# Altium project RK_NVR_DEMO1_RK3588_LP4XD200P232SD8_V21_20211228.PrjPcb (part 3 of 19)

## Sheet 13.RK3588_Flash_SD Controller.SchDoc
size 297 x 209 mm; Revision: V2.1; Schematic Page Number: 11; Page Number: 13; Check: <Checker>; Schematic Name: RK_NVR_DEMO1_RK3588_LP4/4x_V21; Page Count: 43; Page name: 13.RK3588_Flash/SD Controller; Designer: Zhangdz; Schematic Page Count: 99; Revcode: V2.1; DsnPath: E:\Work\SBER\RK3588_SOM\temp\RK_NVR_DEMO1_RK3588_LP4XD200P232SD8_V21_20211228.DSN; SchematicName: RK_NVR_DEMO1_RK3588_LP4/4x_V21; PageName: 13.RK3588_Flash/SD Controller; PageSize: A4; TopSchematic: True
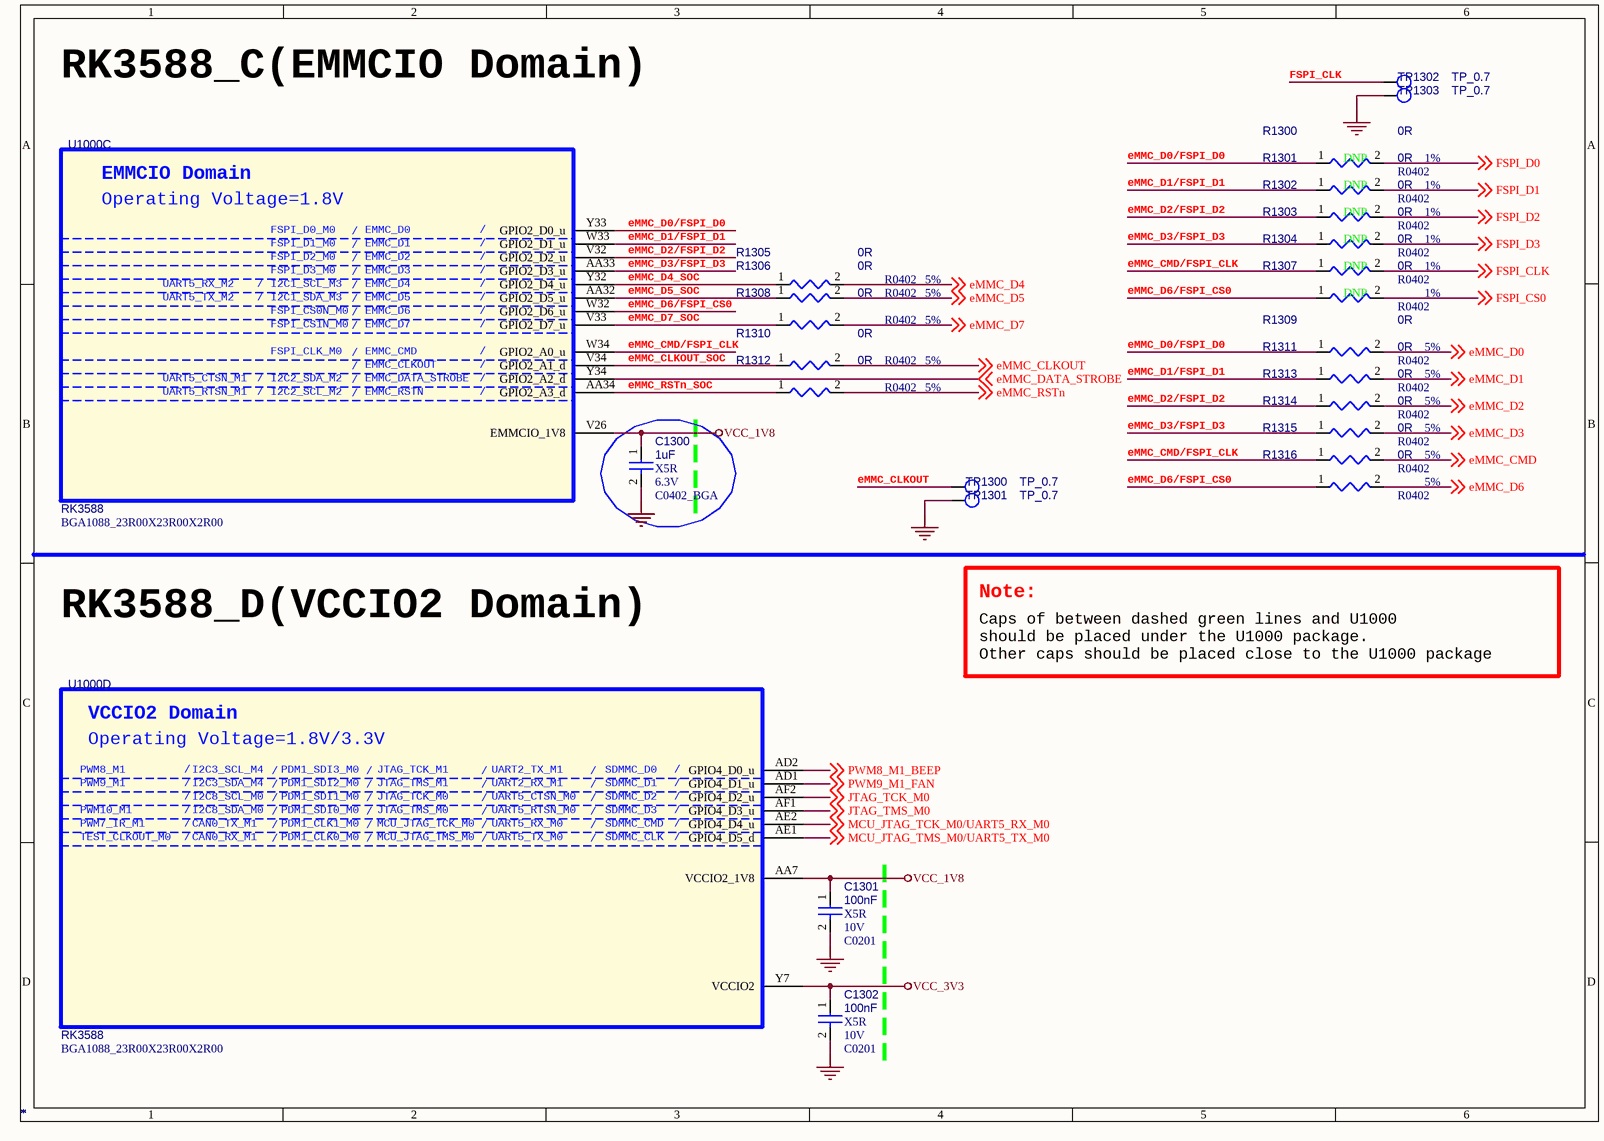
[diagram p28: 13.RK3588_Flash_SD Controller.SchDoc]

### Parts
C1300  *  Voltage: 6.3V  Dielectric: X5R  [C0402_BGA]
C1301  *  Voltage: 10V  Dielectric: X5R  [C0201]
C1302  *  Voltage: 10V  Dielectric: X5R  [C0201]
R1300  *  Tolerance: 1%  OPTION: DNP  [R0402]
R1301  *  Tolerance: 1%  OPTION: DNP  [R0402]
R1302  *  Tolerance: 1%  OPTION: DNP  [R0402]
R1303  *  Tolerance: 1%  OPTION: DNP  [R0402]
R1304  *  Tolerance: 1%  OPTION: DNP  [R0402]
R1305  *  Tolerance: 5%  [R0402]
R1306  *  Tolerance: 5%  [R0402]
R1307  *  Tolerance: 1%  OPTION: DNP  [R0402]
R1308  *  Tolerance: 5%  [R0402]
R1309  *  Tolerance: 5%  [R0402]
R1310  *  Tolerance: 5%  [R0402]
R1311  *  Tolerance: 5%  [R0402]
R1312  *  Tolerance: 5%  [R0402]
R1313  *  Tolerance: 5%  [R0402]
R1314  *  Tolerance: 5%  [R0402]
R1315  *  Tolerance: 5%  [R0402]
R1316  *  Tolerance: 5%  [R0402]
TP1300  *  [TEST]
TP1301  *  [TEST]
TP1302  *  [TEST]
TP1303  *  [TEST]
U1000  *  [BGA1088_23R00X23R00X2R00]  (parts C,D of 26)

### Nets
GND: C1300.2 C1301.2 C1302.2 TP1301.1 TP1303.1
VCC_1V8: C1300.1 C1301.1 U1000.AA7(VCCIO2_1V8) U1000.V26(EMMCIO_1V8)
VCC_3V3: C1302.1 U1000.Y7(VCCIO2)
eMMC_CLKOUT: R1310.2 TP1300.1 ; off-sheet eMMC_CLKOUT
eMMC_CLKOUT_SOC: R1310.1 U1000.V34(GPIO2_A1_d)
eMMC_CMD: R1315.2 ; off-sheet eMMC_CMD
eMMC_CMD/FSPI_CLK: R1304.1 R1315.1 U1000.W34(GPIO2_A0_u)
eMMC_D0: R1309.2 ; off-sheet eMMC_D0
eMMC_D0/FSPI_D0: R1300.1 R1309.1 U1000.Y33(GPIO2_D0_u)
eMMC_D1: R1311.2 ; off-sheet eMMC_D1
eMMC_D1/FSPI_D1: R1301.1 R1311.1 U1000.W33(GPIO2_D1_u)
eMMC_D2: R1313.2 ; off-sheet eMMC_D2
eMMC_D2/FSPI_D2: R1302.1 R1313.1 U1000.V32(GPIO2_D2_u)
eMMC_D3: R1314.2 ; off-sheet eMMC_D3
eMMC_D3/FSPI_D3: R1303.1 R1314.1 U1000.AA33(GPIO2_D3_u)
eMMC_D4: R1305.2 ; off-sheet eMMC_D4
eMMC_D4_SOC: R1305.1 U1000.Y32(GPIO2_D4_u)
eMMC_D5: R1306.2 ; off-sheet eMMC_D5
eMMC_D5_SOC: R1306.1 U1000.AA32(GPIO2_D5_u)
eMMC_D6: R1316.2 ; off-sheet eMMC_D6
eMMC_D6/FSPI_CS0: R1307.1 R1316.1 U1000.W32(GPIO2_D6_u)
eMMC_D7: R1308.2 ; off-sheet eMMC_D7
eMMC_D7_SOC: R1308.1 U1000.V33(GPIO2_D7_u)
eMMC_DATA_STROBE: U1000.Y34(GPIO2_A2_d) ; off-sheet eMMC_DATA_STROBE
eMMC_RSTn: R1312.2 ; off-sheet eMMC_RSTn
eMMC_RSTn_SOC: R1312.1 U1000.AA34(GPIO2_A3_d)
FSPI_CLK: R1304.2 TP1302.1 ; off-sheet FSPI_CLK
FSPI_CS0: R1307.2 ; off-sheet FSPI_CS0
FSPI_D0: R1300.2 ; off-sheet FSPI_D0
FSPI_D1: R1301.2 ; off-sheet FSPI_D1
FSPI_D2: R1302.2 ; off-sheet FSPI_D2
FSPI_D3: R1303.2 ; off-sheet FSPI_D3
JTAG_TCK_M0: U1000.AF2(GPIO4_D2_u) ; off-sheet JTAG_TCK_M0
JTAG_TMS_M0: U1000.AF1(GPIO4_D3_u) ; off-sheet JTAG_TMS_M0
MCU_JTAG_TCK_M0/UART5_RX_M0: U1000.AE2(GPIO4_D4_u) ; off-sheet MCU_JTAG_TCK_M0/UART5_RX_M0
MCU_JTAG_TMS_M0/UART5_TX_M0: U1000.AE1(GPIO4_D5_d) ; off-sheet MCU_JTAG_TMS_M0/UART5_TX_M0
PWM8_M1_BEEP: U1000.AD2(GPIO4_D0_u) ; off-sheet PWM8_M1_BEEP
PWM9_M1_FAN: U1000.AD1(GPIO4_D1_u) ; off-sheet PWM9_M1_FAN

### Notes on the sheet
- RK3588_C(EMMCIO Domain)
- Note:
- RK3588_D(VCCIO2 Domain)
- Caps of between dashed green lines and U1000
  should be placed under the U1000 package.
  Other caps should be placed close to the U1000 package
- (in symbol SOC_RK3588, part C) EMMCIO Domain; Operating Voltage=1.8V; FSPI_D0_M0; /; EMMC_D0; FSPI_D1_M0; EMMC_D1; FSPI_D2_M0; EMMC_D2; FSPI_D3_M0; EMMC_D3; UART5_RX_M2; I2C1_SCL_M3; EMMC_D4; UART5_TX_M2; I2C1_SDA_M3; EMMC_D5; FSPI_CS0N_M0; EMMC_D6; FSPI_CS1N_M0; EMMC_D7; FSPI_CLK_M0; EMMC_CMD; EMMC_CLKOUT; UART5_CTSN_M1; I2C2_SDA_M2; EMMC_DATA_STROBE; UART5_RTSN_M1; I2C2_SCL_M2; EMMC_RSTN
- (in symbol SOC_RK3588, part D) VCCIO2 Domain; Operating Voltage=1.8V/3.3V; PWM8_M1; /; I2C3_SCL_M4; PDM1_SDI3_M0; JTAG_TCK_M1; UART2_TX_M1; SDMMC_D0; PWM9_M1; I2C3_SDA_M4; PDM1_SDI2_M0; JTAG_TMS_M1; UART2_RX_M1; SDMMC_D1; I2C8_SCL_M0; PDM1_SDI1_M0; JTAG_TCK_M0; UART5_CTSN_M0; SDMMC_D2; PWM10_M1; I2C8_SDA_M0; PDM1_SDI0_M0; JTAG_TMS_M0; UART5_RTSN_M0; SDMMC_D3; PWM7_IR_M1; CAN0_TX_M1; PDM1_CLK1_M0; MCU_JTAG_TCK_M0; UART5_RX_M0; SDMMC_CMD; TEST_CLKOUT_M0; CAN0_RX_M1; PDM1_CLK0_M0; MCU_JTAG_TMS_M0; UART5_TX_M0; SDMMC_CLK

### Library data of the parts
C1300 = CAP NP: cap,1.00uF,+/-10%,6.3V,X5R,C0402; Part Reference: C1300; Manufacturer PN: C1005X5R0J105K050BB; Manufacturer: TDK; Value: 1uF; Tolerance: 10%; Priority: A; PCB Footprint: C0402_BGA; Created by: JJJ; Part Type: C0402; RK PN: C1005X5R0J105K050BB
C1301 = CAP NP: cap,100.00nF,+/-10%,10V,X5R,C0201; Part Reference: C1301; Manufacturer PN: C0603X5R1A104K030BC; Manufacturer: TDK; Value: 100nF; Tolerance: 10%; Priority: A; PCB Footprint: C0201; Created by: JJJ; Part Type: C0201; RK PN: C0603X5R1A104K030BC
C1302 = CAP NP: cap,100.00nF,+/-10%,10V,X5R,C0201; Part Reference: C1302; Manufacturer PN: C0603X5R1A104K030BC; Manufacturer: TDK; Value: 100nF; Tolerance: 10%; Priority: A; PCB Footprint: C0201; Created by: JJJ; Part Type: C0201; RK PN: C0603X5R1A104K030BC
R1300 = RESISTOR_Dup1: НЁУГєсД¤µзЧи,0R,+/-1%,R0402,1/16W.; Part Reference: R1300; Manufacturer: YAGEO; RK PN: RC0402FR-070RL; Priority: A; Wattage: 1/16W; PCB Footprint: R0402; Value: 0R; Part Type: НЁУГєсД¤µзЧи; Manufacturer PN: RC0402FR-070RL; Created by: YTL
R1301 = RESISTOR_Dup1: НЁУГєсД¤µзЧи,0R,+/-1%,R0402,1/16W.; Part Reference: R1301; Manufacturer: YAGEO; RK PN: RC0402FR-070RL; Priority: A; Wattage: 1/16W; PCB Footprint: R0402; Value: 0R; Part Type: НЁУГєсД¤µзЧи; Manufacturer PN: RC0402FR-070RL; Created by: YTL
R1302 = RESISTOR_Dup1: НЁУГєсД¤µзЧи,0R,+/-1%,R0402,1/16W.; Part Reference: R1302; Manufacturer: YAGEO; RK PN: RC0402FR-070RL; Priority: A; Wattage: 1/16W; PCB Footprint: R0402; Value: 0R; Part Type: НЁУГєсД¤µзЧи; Manufacturer PN: RC0402FR-070RL; Created by: YTL
R1303 = RESISTOR_Dup1: НЁУГєсД¤µзЧи,0R,+/-1%,R0402,1/16W.; Part Reference: R1303; Manufacturer: YAGEO; RK PN: RC0402FR-070RL; Priority: A; Wattage: 1/16W; PCB Footprint: R0402; Value: 0R; Part Type: НЁУГєсД¤µзЧи; Manufacturer PN: RC0402FR-070RL; Created by: YTL
R1304 = RESISTOR_Dup1: НЁУГєсД¤µзЧи,0R,+/-1%,R0402,1/16W.; Part Reference: R1304; Manufacturer: YAGEO; RK PN: RC0402FR-070RL; Priority: A; Wattage: 1/16W; PCB Footprint: R0402; Value: 0R; Part Type: НЁУГєсД¤µзЧи; Manufacturer PN: RC0402FR-070RL; Created by: YTL
R1305 = RESISTOR_Dup1: НЁУГєсД¤µзЧи,0R,+/-5%,R0402,1/16W.; Part Reference: R1305; Manufacturer PN: RC0402JR-070RL; Manufacturer: YAGEO; Wattage: 1/16W; Priority: A; PCB Footprint: R0402; Value: 0R; Created by: YTL; Part Type: НЁУГєсД¤µзЧи; RK PN: RC0402JR-070RL
R1306 = RESISTOR_Dup1: НЁУГєсД¤µзЧи,0R,+/-5%,R0402,1/16W.; Part Reference: R1306; Manufacturer: YAGEO; RK PN: RC0402JR-070RL; Priority: A; Wattage: 1/16W; PCB Footprint: R0402; Value: 0R; Part Type: НЁУГєсД¤µзЧи; Manufacturer PN: RC0402JR-070RL; Created by: YTL
R1307 = RESISTOR_Dup1: НЁУГєсД¤µзЧи,0R,+/-1%,R0402,1/16W.; Part Reference: R1307; Manufacturer: YAGEO; RK PN: RC0402FR-070RL; Priority: A; Wattage: 1/16W; PCB Footprint: R0402; Value: 0R; Part Type: НЁУГєсД¤µзЧи; Manufacturer PN: RC0402FR-070RL; Created by: YTL
R1308 = RESISTOR_Dup1: НЁУГєсД¤µзЧи,0R,+/-5%,R0402,1/16W.; Part Reference: R1308; Manufacturer PN: RC0402JR-070RL; Manufacturer: YAGEO; Wattage: 1/16W; Priority: A; PCB Footprint: R0402; Value: 0R; Created by: YTL; Part Type: НЁУГєсД¤µзЧи; RK PN: RC0402JR-070RL
R1309 = RESISTOR_Dup1: НЁУГєсД¤µзЧи,0R,+/-5%,R0402,1/16W.; Part Reference: R1309; Manufacturer PN: RC0402JR-070RL; Manufacturer: YAGEO; Wattage: 1/16W; Priority: A; PCB Footprint: R0402; Value: 0R; Created by: YTL; Part Type: НЁУГєсД¤µзЧи; RK PN: RC0402JR-070RL
R1310 = RESISTOR_Dup1: НЁУГєсД¤µзЧи,0R,+/-5%,R0402,1/16W.; Part Reference: R1310; Manufacturer: YAGEO; RK PN: RC0402JR-070RL; Priority: A; Wattage: 1/16W; PCB Footprint: R0402; Value: 0R; Part Type: НЁУГєсД¤µзЧи; Manufacturer PN: RC0402JR-070RL; Created by: YTL
R1311 = RESISTOR_Dup1: НЁУГєсД¤µзЧи,0R,+/-5%,R0402,1/16W.; Part Reference: R1311; Manufacturer PN: RC0402JR-070RL; Manufacturer: YAGEO; Wattage: 1/16W; Priority: A; PCB Footprint: R0402; Value: 0R; Created by: YTL; Part Type: НЁУГєсД¤µзЧи; RK PN: RC0402JR-070RL
R1312 = RESISTOR_Dup1: НЁУГєсД¤µзЧи,0R,+/-5%,R0402,1/16W.; Part Reference: R1312; Manufacturer: YAGEO; RK PN: RC0402JR-070RL; Priority: A; Wattage: 1/16W; PCB Footprint: R0402; Value: 0R; Part Type: НЁУГєсД¤µзЧи; Manufacturer PN: RC0402JR-070RL; Created by: YTL
R1313 = RESISTOR_Dup1: НЁУГєсД¤µзЧи,0R,+/-5%,R0402,1/16W.; Part Reference: R1313; Manufacturer PN: RC0402JR-070RL; Manufacturer: YAGEO; Wattage: 1/16W; Priority: A; PCB Footprint: R0402; Value: 0R; Created by: YTL; Part Type: НЁУГєсД¤µзЧи; RK PN: RC0402JR-070RL
R1314 = RESISTOR_Dup1: НЁУГєсД¤µзЧи,0R,+/-5%,R0402,1/16W.; Part Reference: R1314; Manufacturer PN: RC0402JR-070RL; Manufacturer: YAGEO; Wattage: 1/16W; Priority: A; PCB Footprint: R0402; Value: 0R; Created by: YTL; Part Type: НЁУГєсД¤µзЧи; RK PN: RC0402JR-070RL
R1315 = RESISTOR_Dup1: НЁУГєсД¤µзЧи,0R,+/-5%,R0402,1/16W.; Part Reference: R1315; Manufacturer PN: RC0402JR-070RL; Manufacturer: YAGEO; Wattage: 1/16W; Priority: A; PCB Footprint: R0402; Value: 0R; Created by: YTL; Part Type: НЁУГєсД¤µзЧи; RK PN: RC0402JR-070RL
R1316 = RESISTOR_Dup1: НЁУГєсД¤µзЧи,0R,+/-5%,R0402,1/16W.; Part Reference: R1316; Manufacturer PN: RC0402JR-070RL; Manufacturer: YAGEO; Wattage: 1/16W; Priority: A; PCB Footprint: R0402; Value: 0R; Created by: YTL; Part Type: НЁУГєсД¤µзЧи; RK PN: RC0402JR-070RL
TP1300 = TP: Test Point 0.7mm; Part Reference: TP1300; PCB Footprint: TP_0R70; Value: TP_0.7; RK PN: TESTPOINT_0R7; Priority: A; Part Type: TP; Created by: JJJ
TP1301 = TP: Test Point 0.7mm; Part Reference: TP1301; PCB Footprint: TP_0R70; Value: TP_0.7; RK PN: TESTPOINT_0R7; Priority: A; Part Type: TP; Created by: JJJ
TP1302 = TP: Test Point 0.7mm; Part Reference: TP1302; PCB Footprint: TP_0R70; Value: TP_0.7; Priority: A; RK PN: TESTPOINT_0R7; Created by: JJJ; Part Type: TP
TP1303 = TP: Test Point 0.7mm; Part Reference: TP1303; PCB Footprint: TP_0R70; Value: TP_0.7; RK PN: TESTPOINT_0R7; Priority: A; Part Type: TP; Created by: JJJ
U1000 = SOC_RK3588: as U1000 on sheet 11.RK3588_OSC_PLL_PMUIO; RK PN: RK3588; Part Type: SOC; Manufacturer PN: RK3588; Created by: YWQ; PCB Footprint: BGA1088_23R00X23R00X2R00

## Sheet 14.RK3588_USB30_USB20_Ctrl.SchDoc
size 420 x 297 mm; Revision: V2.1; Schematic Page Number: 11; Page Number: 14; Check: <Checker>; Schematic Name: RK_NVR_DEMO1_RK3588_LP4/4x_V21; Page Count: 43; Page name: 14.RK3588_USB30/USB20_Ctrl; Designer: Zhangdz; Schematic Page Count: 99; Revcode: V2.1; DsnPath: E:\Work\SBER\RK3588_SOM\temp\RK_NVR_DEMO1_RK3588_LP4XD200P232SD8_V21_20211228.DSN; SchematicName: RK_NVR_DEMO1_RK3588_LP4/4x_V21; PageName: 14.RK3588_USB30/USB20_Ctrl; PageSize: A3; TopSchematic: True
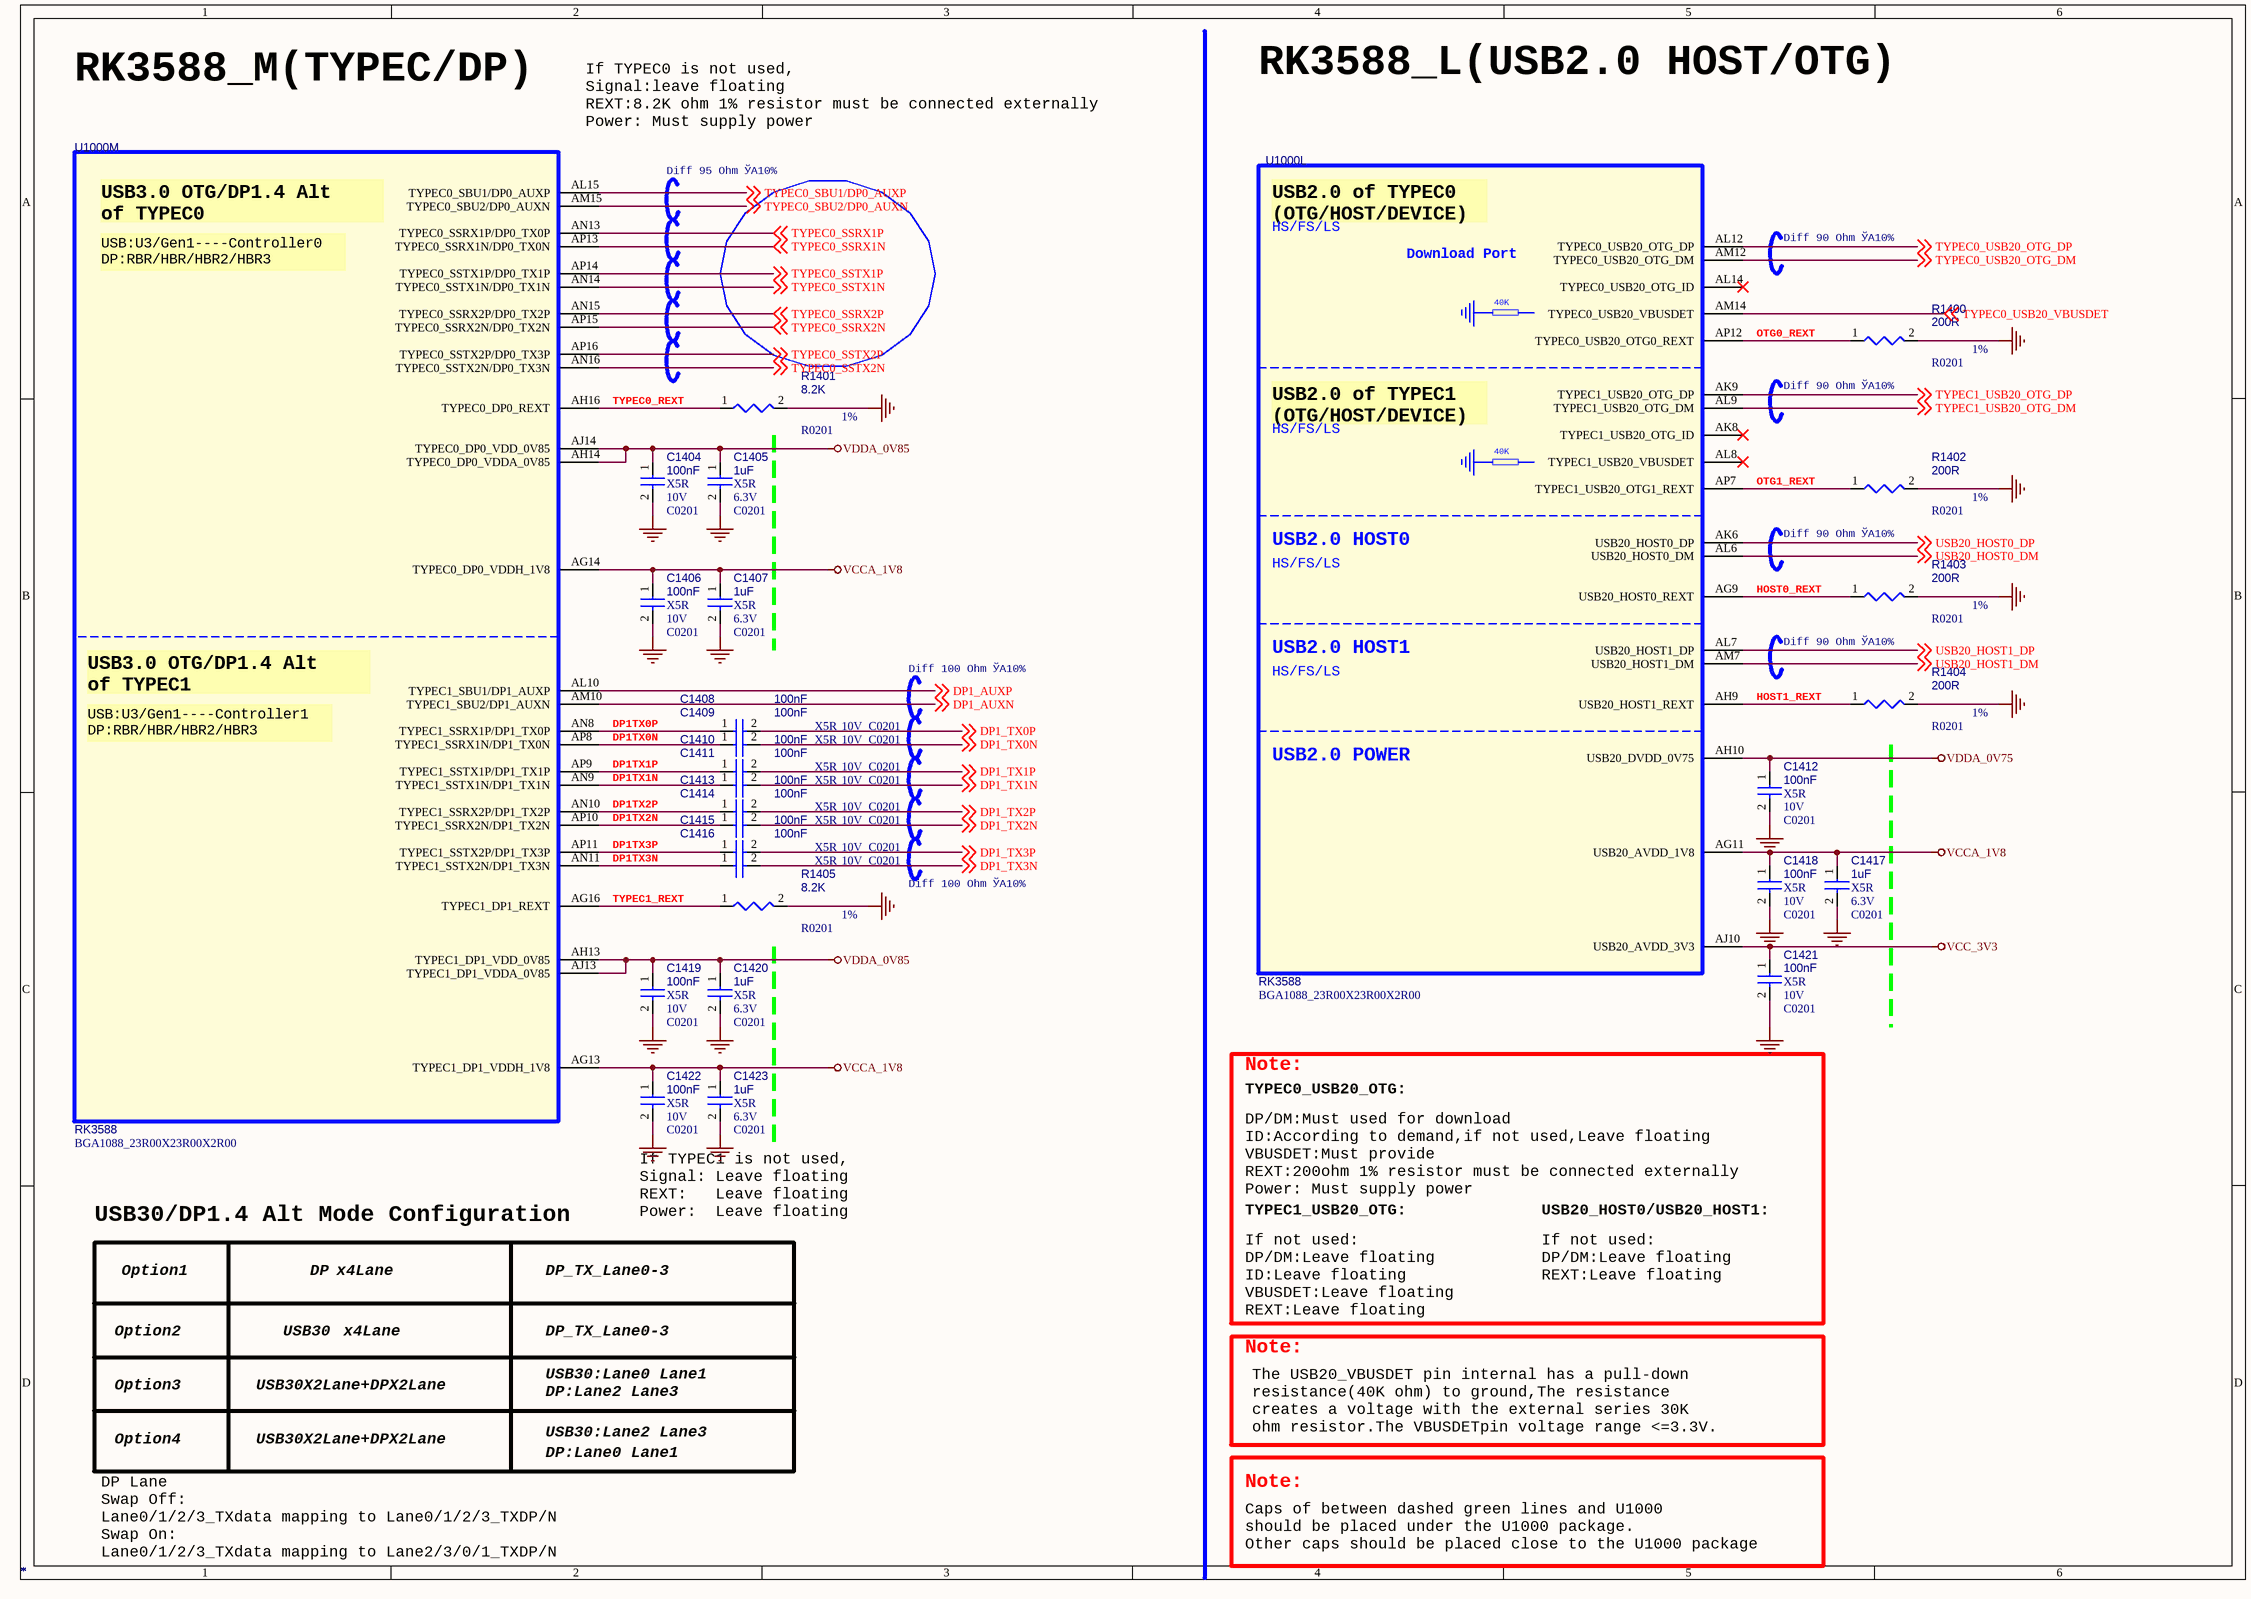
[diagram p29: 14.RK3588_USB30_USB20_Ctrl.SchDoc]

### Parts
C1404  *  Voltage: 10V  Dielectric: X5R  [C0201]
C1405  *  Voltage: 6.3V  Dielectric: X5R  [C0201]
C1406  *  Voltage: 10V  Dielectric: X5R  [C0201]
C1407  *  Voltage: 6.3V  Dielectric: X5R  [C0201]
C1408  *  Voltage: 10V  Dielectric: X5R  [C0201]
C1409  *  Voltage: 10V  Dielectric: X5R  [C0201]
C1410  *  Voltage: 10V  Dielectric: X5R  [C0201]
C1411  *  Voltage: 10V  Dielectric: X5R  [C0201]
C1412  *  Voltage: 10V  Dielectric: X5R  [C0201]
C1413  *  Voltage: 10V  Dielectric: X5R  [C0201]
C1414  *  Voltage: 10V  Dielectric: X5R  [C0201]
C1415  *  Voltage: 10V  Dielectric: X5R  [C0201]
C1416  *  Voltage: 10V  Dielectric: X5R  [C0201]
C1417  *  Voltage: 6.3V  Dielectric: X5R  [C0201]
C1418  *  Voltage: 10V  Dielectric: X5R  [C0201]
C1419  *  Voltage: 10V  Dielectric: X5R  [C0201]
C1420  *  Voltage: 6.3V  Dielectric: X5R  [C0201]
C1421  *  Voltage: 10V  Dielectric: X5R  [C0201]
C1422  *  Voltage: 10V  Dielectric: X5R  [C0201]
C1423  *  Voltage: 6.3V  Dielectric: X5R  [C0201]
R1400  *  PCB Footprint: R0201  Tolerance: 1%  [R0402]
R1401  *  PCB Footprint: R0201  Tolerance: 1%  [R0402]
R1402  *  PCB Footprint: R0201  Tolerance: 1%  [R0402]
R1403  *  PCB Footprint: R0201  Tolerance: 1%  [R0402]
R1404  *  PCB Footprint: R0201  Tolerance: 1%  [R0402]
R1405  *  PCB Footprint: R0201  Tolerance: 1%  [R0402]
U1000  *  [BGA1088_23R00X23R00X2R00]  (parts L,M of 26)

### Nets
GND: C1404.2 C1405.2 C1406.2 C1407.2 C1412.2 C1417.2 C1418.2 C1419.2 C1420.2 C1421.2 C1422.2 C1423.2 R1400.2 R1401.2 R1402.2 R1403.2 R1404.2 R1405.2
VCC_3V3: C1421.1 U1000.AJ10(USB20_AVDD_3V3)
VCCA_1V8: C1406.1 C1407.1 C1417.1 C1418.1 C1422.1 C1423.1 U1000.AG11(USB20_AVDD_1V8) U1000.AG13(TYPEC1_DP1_VDDH_1V8) U1000.AG14(TYPEC0_DP0_VDDH_1V8)
VDDA_0V75: C1412.1 U1000.AH10(USB20_DVDD_0V75)
VDDA_0V85: C1404.1 C1405.1 C1419.1 C1420.1 U1000.AH13(TYPEC1_DP1_VDD_0V85) U1000.AH14(TYPEC0_DP0_VDDA_0V85) U1000.AJ13(TYPEC1_DP1_VDDA_0V85) U1000.AJ14(TYPEC0_DP0_VDD_0V85)
DP1_AUXN: U1000.AM10(TYPEC1_SBU2/DP1_AUXN) ; off-sheet DP1_AUXN
DP1_AUXP: U1000.AL10(TYPEC1_SBU1/DP1_AUXP) ; off-sheet DP1_AUXP
DP1_TX0N: C1409.2 ; off-sheet DP1_TX0N
DP1_TX0P: C1408.2 ; off-sheet DP1_TX0P
DP1_TX1N: C1411.2 ; off-sheet DP1_TX1N
DP1_TX1P: C1410.2 ; off-sheet DP1_TX1P
DP1_TX2N: C1414.2 ; off-sheet DP1_TX2N
DP1_TX2P: C1413.2 ; off-sheet DP1_TX2P
DP1_TX3N: C1416.2 ; off-sheet DP1_TX3N
DP1_TX3P: C1415.2 ; off-sheet DP1_TX3P
DP1TX0N: C1409.1 U1000.AP8(TYPEC1_SSRX1N/DP1_TX0N)
DP1TX0P: C1408.1 U1000.AN8(TYPEC1_SSRX1P/DP1_TX0P)
DP1TX1N: C1411.1 U1000.AN9(TYPEC1_SSTX1N/DP1_TX1N)
DP1TX1P: C1410.1 U1000.AP9(TYPEC1_SSTX1P/DP1_TX1P)
DP1TX2N: C1414.1 U1000.AP10(TYPEC1_SSRX2N/DP1_TX2N)
DP1TX2P: C1413.1 U1000.AN10(TYPEC1_SSRX2P/DP1_TX2P)
DP1TX3N: C1416.1 U1000.AN11(TYPEC1_SSTX2N/DP1_TX3N)
DP1TX3P: C1415.1 U1000.AP11(TYPEC1_SSTX2P/DP1_TX3P)
HOST0_REXT: R1403.1 U1000.AG9(USB20_HOST0_REXT)
HOST1_REXT: R1404.1 U1000.AH9(USB20_HOST1_REXT)
OTG0_REXT: R1400.1 U1000.AP12(TYPEC0_USB20_OTG0_REXT)
OTG1_REXT: R1402.1 U1000.AP7(TYPEC1_USB20_OTG1_REXT)
TYPEC0_REXT: R1401.1 U1000.AH16(TYPEC0_DP0_REXT)
TYPEC0_SBU1/DP0_AUXP: U1000.AL15(TYPEC0_SBU1/DP0_AUXP) ; off-sheet TYPEC0_SBU1/DP0_AUXP
TYPEC0_SBU2/DP0_AUXN: U1000.AM15(TYPEC0_SBU2/DP0_AUXN) ; off-sheet TYPEC0_SBU2/DP0_AUXN
TYPEC0_SSRX1N: U1000.AP13(TYPEC0_SSRX1N/DP0_TX0N) ; off-sheet TYPEC0_SSRX1N
TYPEC0_SSRX1P: U1000.AN13(TYPEC0_SSRX1P/DP0_TX0P) ; off-sheet TYPEC0_SSRX1P
TYPEC0_SSRX2N: U1000.AP15(TYPEC0_SSRX2N/DP0_TX2N) ; off-sheet TYPEC0_SSRX2N
TYPEC0_SSRX2P: U1000.AN15(TYPEC0_SSRX2P/DP0_TX2P) ; off-sheet TYPEC0_SSRX2P
TYPEC0_SSTX1N: U1000.AN14(TYPEC0_SSTX1N/DP0_TX1N) ; off-sheet TYPEC0_SSTX1N
TYPEC0_SSTX1P: U1000.AP14(TYPEC0_SSTX1P/DP0_TX1P) ; off-sheet TYPEC0_SSTX1P
TYPEC0_SSTX2N: U1000.AN16(TYPEC0_SSTX2N/DP0_TX3N) ; off-sheet TYPEC0_SSTX2N
TYPEC0_SSTX2P: U1000.AP16(TYPEC0_SSTX2P/DP0_TX3P) ; off-sheet TYPEC0_SSTX2P
TYPEC0_USB20_OTG_DM: U1000.AM12(TYPEC0_USB20_OTG_DM) ; off-sheet TYPEC0_USB20_OTG_DM
TYPEC0_USB20_OTG_DP: U1000.AL12(TYPEC0_USB20_OTG_DP) ; off-sheet TYPEC0_USB20_OTG_DP
TYPEC0_USB20_VBUSDET: U1000.AM14(TYPEC0_USB20_VBUSDET) ; off-sheet TYPEC0_USB20_VBUSDET
TYPEC1_REXT: R1405.1 U1000.AG16(TYPEC1_DP1_REXT)
TYPEC1_USB20_OTG_DM: U1000.AL9(TYPEC1_USB20_OTG_DM) ; off-sheet TYPEC1_USB20_OTG_DM
TYPEC1_USB20_OTG_DP: U1000.AK9(TYPEC1_USB20_OTG_DP) ; off-sheet TYPEC1_USB20_OTG_DP
USB20_HOST0_DM: U1000.AL6(USB20_HOST0_DM) ; off-sheet USB20_HOST0_DM
USB20_HOST0_DP: U1000.AK6(USB20_HOST0_DP) ; off-sheet USB20_HOST0_DP
USB20_HOST1_DM: U1000.AM7(USB20_HOST1_DM) ; off-sheet USB20_HOST1_DM
USB20_HOST1_DP: U1000.AL7(USB20_HOST1_DP) ; off-sheet USB20_HOST1_DP

Not connected (* = marked no-connect by the designer): U1000 AK8(TYPEC1_USB20_OTG_ID)* AL8(TYPEC1_USB20_VBUSDET)* AL14(TYPEC0_USB20_OTG_ID)*

### Notes on the sheet
- RK3588_M(TYPEC/DP)
- If TYPEC0 is not used,
  Signal:leave floating
  REXT:8.2K ohm 1% resistor must be connected externally
  Power: Must supply power
- RK3588_L(USB2.0 HOST/OTG)
- Diff 95 Ohm ЎА10%
- Diff 90 Ohm ЎА10%
- (near R1400) Diff 90 Ohm ЎА10%
- Diff 100 Ohm ЎА10%
- TYPEC0_USB20_OTG:
- Note:
- DP/DM:Must used for download
  ID:According to demand,if not used,Leave floating
  VBUSDET:Must provide
  REXT:200ohm 1% resistor must be connected externally
  Power: Must supply power
- USB30/DP1.4 Alt Mode Configuration
- If TYPEC1 is not used,
  Signal: Leave floating
  REXT:   Leave floating
  Power:  Leave floating
- TYPEC1_USB20_OTG:
- USB20_HOST0/USB20_HOST1:
- Option2
- Option1
- USB30
- DP
- x4Lane
- DP_TX_Lane0-3
- If not used:
  DP/DM:Leave floating
  ID:Leave floating
  VBUSDET:Leave floating
  REXT:Leave floating
- If not used:
  DP/DM:Leave floating
  REXT:Leave floating
- Option3
- USB30X2Lane+DPX2Lane
- USB30:Lane0 Lane1
- DP:Lane2 Lane3
- Option4
- USB30:Lane2 Lane3
- DP:Lane0 Lane1
- The USB20_VBUSDET pin internal has a pull-down
  resistance(40K ohm) to ground,The resistance
  creates a voltage with the external series 30K
  ohm resistor.The VBUSDETpin voltage range <=3.3V.
- DP Lane
  Swap Off:
  Lane0/1/2/3_TXdata mapping to Lane0/1/2/3_TXDP/N
  Swap On:
  Lane0/1/2/3_TXdata mapping to Lane2/3/0/1_TXDP/N
- Caps of between dashed green lines and U1000
  should be placed under the U1000 package.
  Other caps should be placed close to the U1000 package
- (in symbol SOC_RK3588, part L) USB2.0 of TYPEC0 / (OTG/HOST/DEVICE); HS/FS/LS; Download Port; 40K; USB2.0 of TYPEC1 / (OTG/HOST/DEVICE); USB2.0 HOST0; USB2.0 HOST1; USB2.0 POWER
- (in symbol SOC_RK3588, part M) USB3.0 OTG/DP1.4 Alt / of TYPEC0; USB:U3/Gen1----Controller0 / DP:RBR/HBR/HBR2/HBR3; USB3.0 OTG/DP1.4 Alt / of TYPEC1; USB:U3/Gen1----Controller1 / DP:RBR/HBR/HBR2/HBR3

### Library data of the parts
C1404 = CAP NP: cap,100.00nF,+/-10%,10V,X5R,C0201; Part Reference: C1404; Manufacturer: TDK; Value: 100nF; RK PN: C0603X5R1A104K030BC; Priority: A; Tolerance: 10%; PCB Footprint: C0201; Part Type: C0201; Manufacturer PN: C0603X5R1A104K030BC; Created by: JJJ
C1405 = CAP NP: cap,1.00uF,+/-20%,6.3V,X5R,C0201; Part Reference: C1405; Manufacturer PN: C0603X5R0J105M030BC; Manufacturer: TDK; Value: 1uF; Tolerance: 20%; Priority: A; PCB Footprint: C0201; Created by: JJJ; Part Type: C0201; RK PN: C0603X5R0J105M030BC
C1406 = CAP NP: cap,100.00nF,+/-10%,10V,X5R,C0201; Part Reference: C1406; Manufacturer: TDK; Value: 100nF; RK PN: C0603X5R1A104K030BC; Priority: A; Tolerance: 10%; PCB Footprint: C0201; Part Type: C0201; Manufacturer PN: C0603X5R1A104K030BC; Created by: JJJ
C1407 = CAP NP: cap,1.00uF,+/-20%,6.3V,X5R,C0201; Part Reference: C1407; Manufacturer PN: C0603X5R0J105M030BC; Manufacturer: TDK; Value: 1uF; Tolerance: 20%; Priority: A; PCB Footprint: C0201; Created by: JJJ; Part Type: C0201; RK PN: C0603X5R0J105M030BC
C1408 = CAP NP: cap,100.00nF,+/-10%,10V,X5R,C0201; Part Reference: C1408; Manufacturer: TDK; Value: 100nF; RK PN: C0603X5R1A104K030BC; Priority: A; Tolerance: 10%; PCB Footprint: C0201; Part Type: C0201; Manufacturer PN: C0603X5R1A104K030BC; Created by: JJJ
C1409 = CAP NP: cap,100.00nF,+/-10%,10V,X5R,C0201; Part Reference: C1409; Manufacturer PN: C0603X5R1A104K030BC; Manufacturer: TDK; Value: 100nF; Tolerance: 10%; Priority: A; PCB Footprint: C0201; Created by: JJJ; Part Type: C0201; RK PN: C0603X5R1A104K030BC
C1410 = CAP NP: cap,100.00nF,+/-10%,10V,X5R,C0201; Part Reference: C1410; Manufacturer: TDK; Value: 100nF; RK PN: C0603X5R1A104K030BC; Priority: A; Tolerance: 10%; PCB Footprint: C0201; Part Type: C0201; Manufacturer PN: C0603X5R1A104K030BC; Created by: JJJ
C1411 = CAP NP: cap,100.00nF,+/-10%,10V,X5R,C0201; Part Reference: C1411; Manufacturer PN: C0603X5R1A104K030BC; Manufacturer: TDK; Value: 100nF; Tolerance: 10%; Priority: A; PCB Footprint: C0201; Created by: JJJ; Part Type: C0201; RK PN: C0603X5R1A104K030BC
C1412 = CAP NP: cap,100.00nF,+/-10%,10V,X5R,C0201; Part Reference: C1412; Manufacturer PN: C0603X5R1A104K030BC; Manufacturer: TDK; Value: 100nF; Tolerance: 10%; Priority: A; PCB Footprint: C0201; Created by: JJJ; Part Type: C0201; RK PN: C0603X5R1A104K030BC
C1413 = CAP NP: cap,100.00nF,+/-10%,10V,X5R,C0201; Part Reference: C1413; Manufacturer: TDK; Value: 100nF; RK PN: C0603X5R1A104K030BC; Priority: A; Tolerance: 10%; PCB Footprint: C0201; Part Type: C0201; Manufacturer PN: C0603X5R1A104K030BC; Created by: JJJ
C1414 = CAP NP: cap,100.00nF,+/-10%,10V,X5R,C0201; Part Reference: C1414; Manufacturer PN: C0603X5R1A104K030BC; Manufacturer: TDK; Value: 100nF; Tolerance: 10%; Priority: A; PCB Footprint: C0201; Created by: JJJ; Part Type: C0201; RK PN: C0603X5R1A104K030BC
C1415 = CAP NP: cap,100.00nF,+/-10%,10V,X5R,C0201; Part Reference: C1415; Manufacturer: TDK; Value: 100nF; RK PN: C0603X5R1A104K030BC; Priority: A; Tolerance: 10%; PCB Footprint: C0201; Part Type: C0201; Manufacturer PN: C0603X5R1A104K030BC; Created by: JJJ
C1416 = CAP NP: cap,100.00nF,+/-10%,10V,X5R,C0201; Part Reference: C1416; Manufacturer PN: C0603X5R1A104K030BC; Manufacturer: TDK; Value: 100nF; Tolerance: 10%; Priority: A; PCB Footprint: C0201; Created by: JJJ; Part Type: C0201; RK PN: C0603X5R1A104K030BC
C1417 = CAP NP: cap,1.00uF,+/-20%,6.3V,X5R,C0201; Part Reference: C1417; Manufacturer: TDK; Value: 1uF; RK PN: C0603X5R0J105M030BC; Priority: A; Tolerance: 20%; PCB Footprint: C0201; Part Type: C0201; Manufacturer PN: C0603X5R0J105M030BC; Created by: JJJ
C1418 = CAP NP: cap,100.00nF,+/-10%,10V,X5R,C0201; Part Reference: C1418; Manufacturer PN: C0603X5R1A104K030BC; Manufacturer: TDK; Value: 100nF; Tolerance: 10%; Priority: A; PCB Footprint: C0201; Created by: JJJ; Part Type: C0201; RK PN: C0603X5R1A104K030BC
C1419 = CAP NP: cap,100.00nF,+/-10%,10V,X5R,C0201; Part Reference: C1419; Manufacturer: TDK; Value: 100nF; RK PN: C0603X5R1A104K030BC; Priority: A; Tolerance: 10%; PCB Footprint: C0201; Part Type: C0201; Manufacturer PN: C0603X5R1A104K030BC; Created by: JJJ
C1420 = CAP NP: cap,1.00uF,+/-20%,6.3V,X5R,C0201; Part Reference: C1420; Manufacturer PN: C0603X5R0J105M030BC; Manufacturer: TDK; Value: 1uF; Tolerance: 20%; Priority: A; PCB Footprint: C0201; Created by: JJJ; Part Type: C0201; RK PN: C0603X5R0J105M030BC
C1421 = CAP NP: cap,100.00nF,+/-10%,10V,X5R,C0201; Part Reference: C1421; Manufacturer PN: C0603X5R1A104K030BC; Manufacturer: TDK; Value: 100nF; Tolerance: 10%; Priority: A; PCB Footprint: C0201; Created by: JJJ; Part Type: C0201; RK PN: C0603X5R1A104K030BC
C1422 = CAP NP: cap,100.00nF,+/-10%,10V,X5R,C0201; Part Reference: C1422; Manufacturer: TDK; Value: 100nF; RK PN: C0603X5R1A104K030BC; Priority: A; Tolerance: 10%; PCB Footprint: C0201; Part Type: C0201; Manufacturer PN: C0603X5R1A104K030BC; Created by: JJJ
C1423 = CAP NP: cap,1.00uF,+/-20%,6.3V,X5R,C0201; Part Reference: C1423; Manufacturer PN: C0603X5R0J105M030BC; Manufacturer: TDK; Value: 1uF; Tolerance: 20%; Priority: A; PCB Footprint: C0201; Created by: JJJ; Part Type: C0201; RK PN: C0603X5R0J105M030BC
R1400 = RESISTOR_Dup1: НЁУГєсД¤µзЧи,200R,+/-1%,R0201,1/20W.; Part Reference: R1400; Manufacturer PN: RC0201FR-07200RL; Manufacturer: YAGEO; Wattage: 1/20W; Priority: A; Value: 200R; Created by: YTL; Part Type: НЁУГєсД¤µзЧи; RK PN: RC0201FR-07200RL
R1401 = RESISTOR_Dup1: НЁУГєсД¤µзЧи,8K2,+/-1%,R0201,1/20W.; Part Reference: R1401; Manufacturer: YAGEO; Value: 8.2K; RK PN: RC0201FR-078K2L; Priority: A; Wattage: 1/20W; Part Type: НЁУГєсД¤µзЧи; Manufacturer PN: RC0201FR-078K2L; Created by: YTL
R1402 = RESISTOR_Dup1: НЁУГєсД¤µзЧи,200R,+/-1%,R0201,1/20W.; Part Reference: R1402; Manufacturer PN: RC0201FR-07200RL; Manufacturer: YAGEO; Wattage: 1/20W; Priority: A; Value: 200R; Created by: YTL; Part Type: НЁУГєсД¤µзЧи; RK PN: RC0201FR-07200RL
R1403 = RESISTOR_Dup1: НЁУГєсД¤µзЧи,200R,+/-1%,R0201,1/20W.; Part Reference: R1403; Manufacturer PN: RC0201FR-07200RL; Manufacturer: YAGEO; Wattage: 1/20W; Priority: A; Value: 200R; Created by: YTL; Part Type: НЁУГєсД¤µзЧи; RK PN: RC0201FR-07200RL
R1404 = RESISTOR_Dup1: НЁУГєсД¤µзЧи,200R,+/-1%,R0201,1/20W.; Part Reference: R1404; Manufacturer PN: RC0201FR-07200RL; Manufacturer: YAGEO; Wattage: 1/20W; Priority: A; Value: 200R; Created by: YTL; Part Type: НЁУГєсД¤µзЧи; RK PN: RC0201FR-07200RL
R1405 = RESISTOR_Dup1: НЁУГєсД¤µзЧи,8K2,+/-1%,R0201,1/20W.; Part Reference: R1405; Manufacturer: YAGEO; Value: 8.2K; RK PN: RC0201FR-078K2L; Priority: A; Wattage: 1/20W; Part Type: НЁУГєсД¤µзЧи; Manufacturer PN: RC0201FR-078K2L; Created by: YTL
U1000 = SOC_RK3588: ROCKCHIP SOC; Part Reference: U1000; Manufacturer: Rockchip (ИрРѕОў); SPLIT_INST: TRUE; SWAP_INFO: (S1+S2+S3+S4+S5+S6+S7+S8+S9+S10+S11+S12+S13+S14+S15+S16+S17+S18+S19+S20+S21+S22+S23+S24+S25+S26); Value: RK3588; Priority: A; Created by: YWQ; Manufacturer PN: RK3588; Part Type: SOC; RK PN: RK3588; PCB Footprint: BGA1088_23R00X23R00X2R00

## Sheet 15.RK3588_SARADC_1.8V Only GPIO.SchDoc
size 420 x 297 mm; Revision: V2.1; Schematic Page Number: 11; Page Number: 15; Check: <Checker>; Schematic Name: RK_NVR_DEMO1_RK3588_LP4/4x_V21; Page Count: 43; Page name: 15.RK3588_SARADC/1.8V Only GPIO; Designer: Zhangdz; Schematic Page Count: 99; Revcode: V2.1; DsnPath: E:\Work\SBER\RK3588_SOM\temp\RK_NVR_DEMO1_RK3588_LP4XD200P232SD8_V21_20211228.DSN; SchematicName: RK_NVR_DEMO1_RK3588_LP4/4x_V21; PageName: 15.RK3588_SARADC/1.8V Only GPIO; PageSize: A3; TopSchematic: True
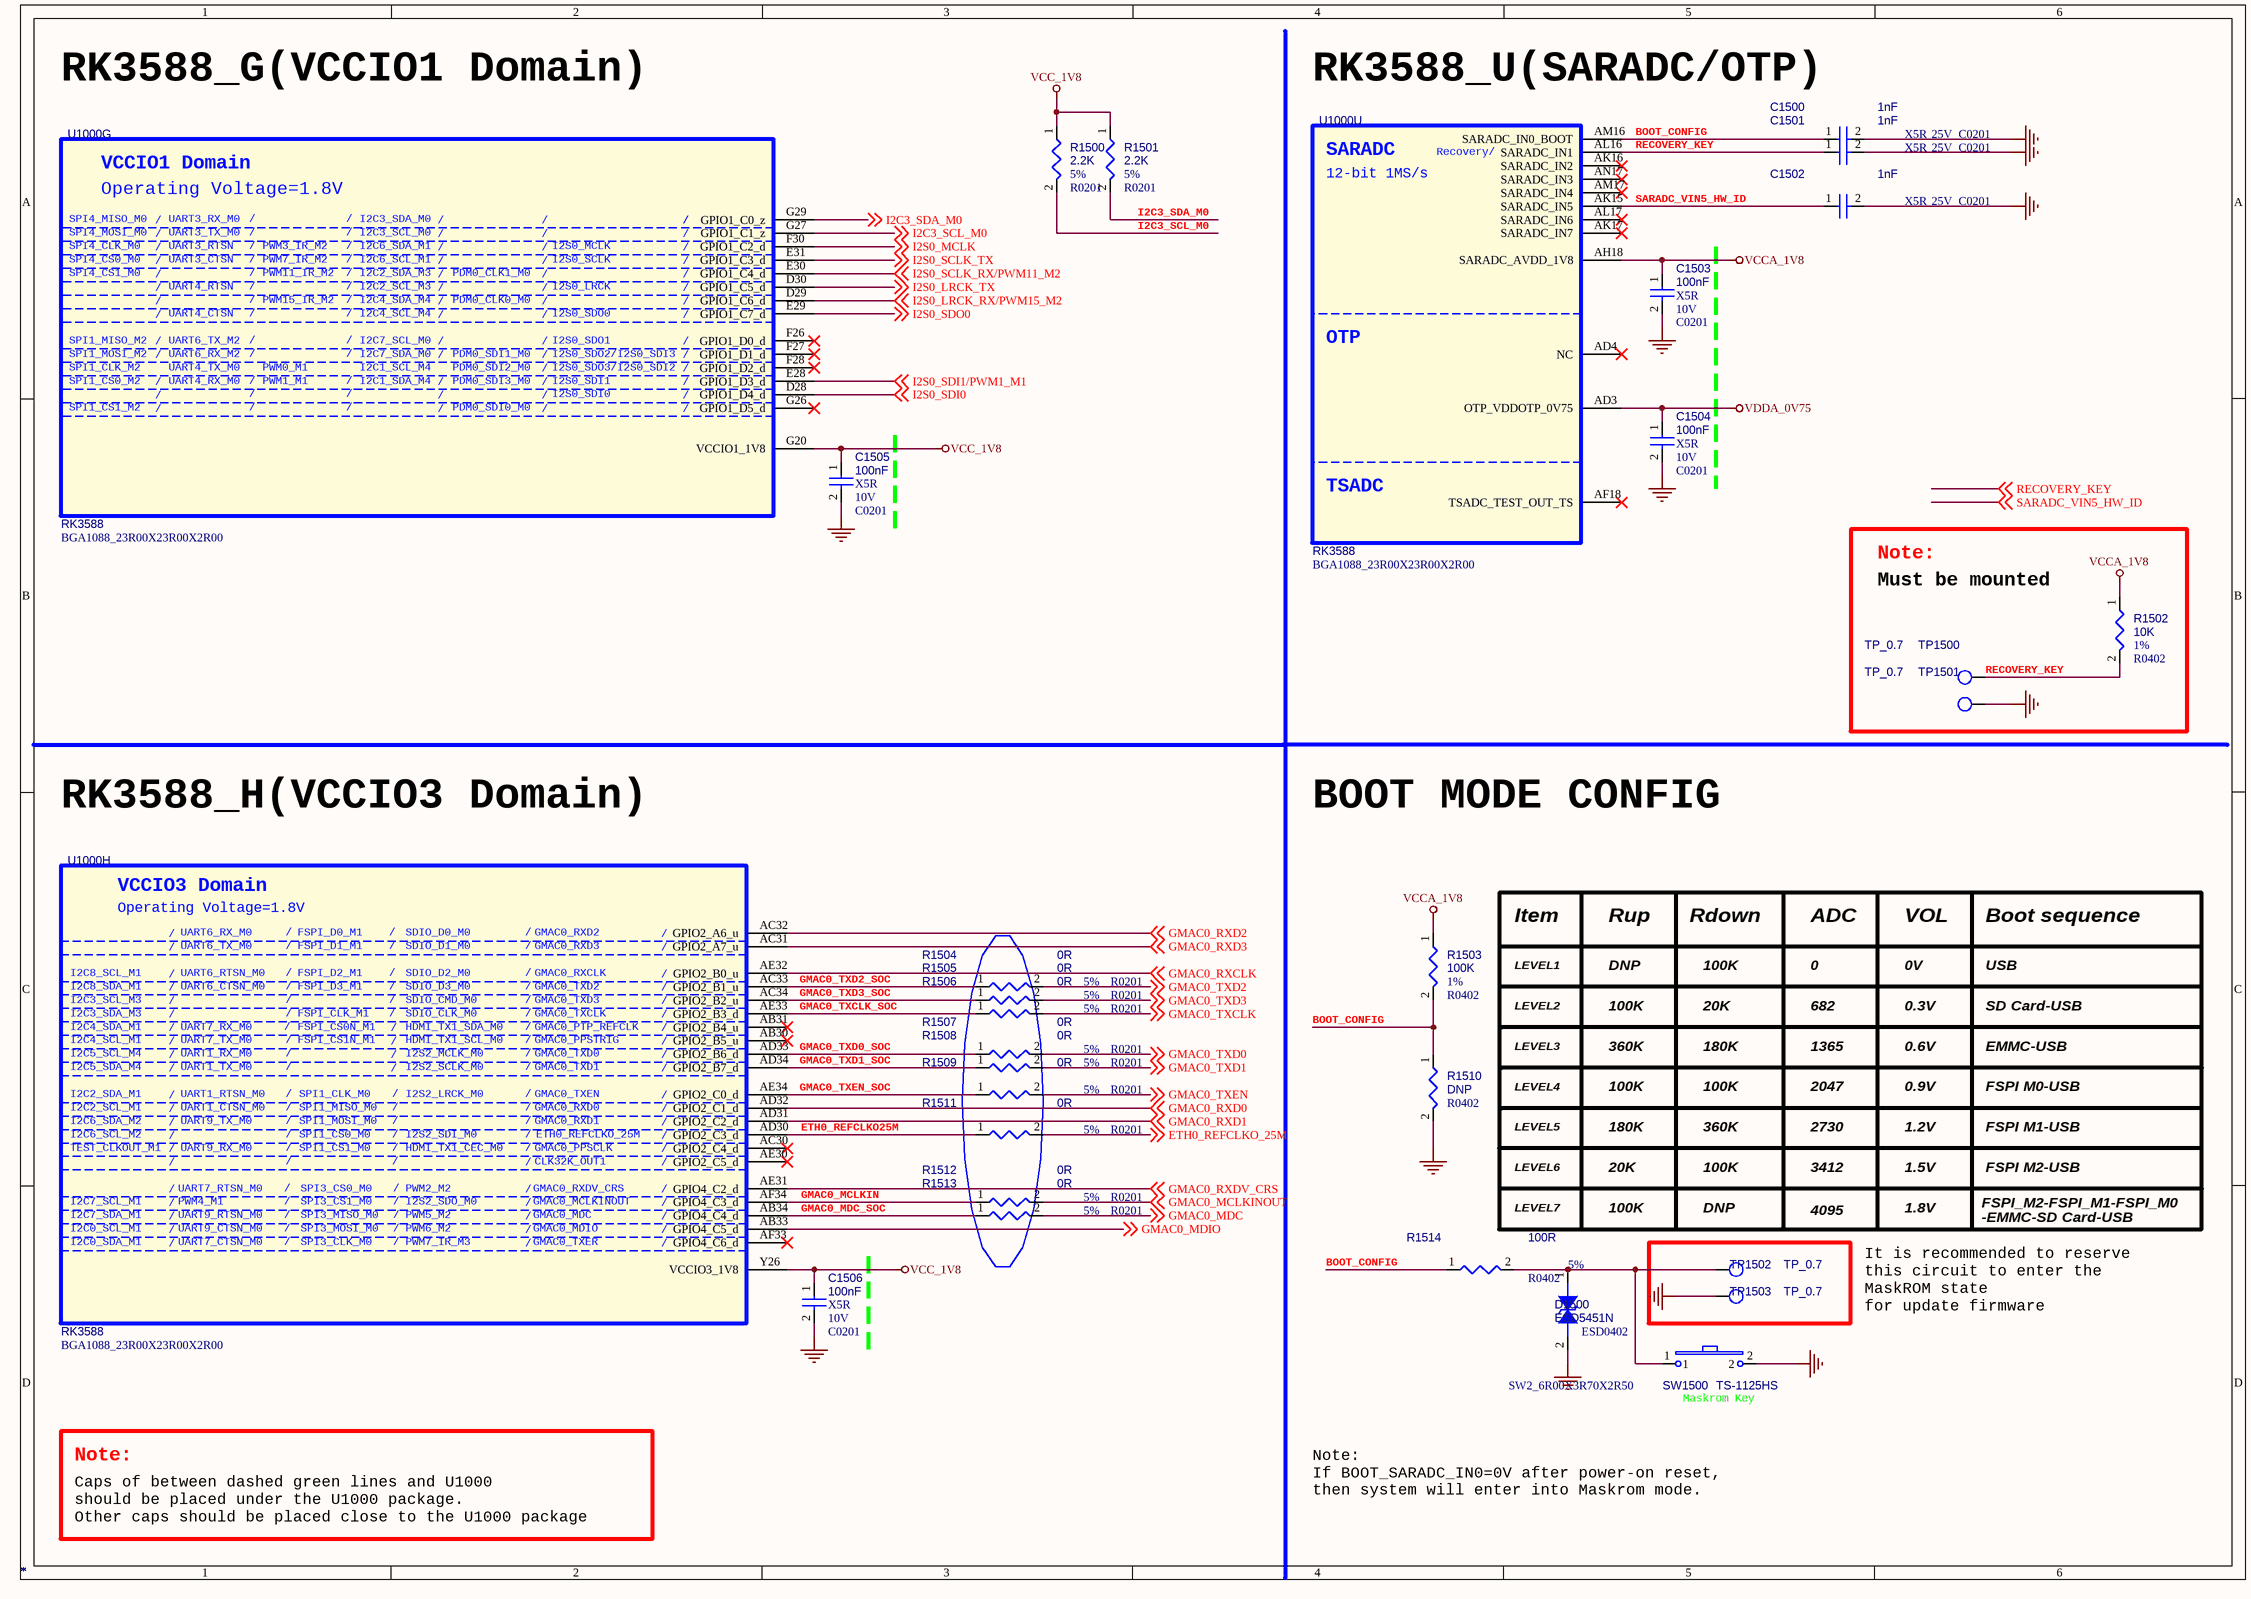
[diagram p30: 15.RK3588_SARADC_1.8V Only GPIO.SchDoc]

### Parts
C1500  *  Voltage: 25V  Dielectric: X5R  [C0201]
C1501  *  Voltage: 25V  Dielectric: X5R  [C0201]
C1502  *  Voltage: 25V  Dielectric: X5R  [C0201]
C1503  *  Voltage: 10V  Dielectric: X5R  [C0201]
C1504  *  Voltage: 10V  Dielectric: X5R  [C0201]
C1505  *  Voltage: 10V  Dielectric: X5R  [C0201]
C1506  *  Voltage: 10V  Dielectric: X5R  [C0201]
D1500  *  [ESD0402]
R1500  *  PCB Footprint: R0201  Tolerance: 5%  [R0402]
R1501  *  PCB Footprint: R0201  Tolerance: 5%  [R0402]
R1502  *  Tolerance: 1%  [R0402]
R1503  *  Tolerance: 1%  [R0402]
R1504  *  PCB Footprint: R0201  Tolerance: 5%  [R0402]
R1505  *  PCB Footprint: R0201  Tolerance: 5%  [R0402]
R1506  *  PCB Footprint: R0201  Tolerance: 5%  [R0402]
R1507  *  PCB Footprint: R0201  Tolerance: 5%  [R0402]
R1508  *  PCB Footprint: R0201  Tolerance: 5%  [R0402]
R1509  *  PCB Footprint: R0201  Tolerance: 5%  [R0402]
R1510  *  [R0402]
R1511  *  PCB Footprint: R0201  Tolerance: 5%  [R0402]
R1512  *  PCB Footprint: R0201  Tolerance: 5%  [R0402]
R1513  *  PCB Footprint: R0201  Tolerance: 5%  [R0402]
R1514  *  Tolerance: 5%  [R0402]
SW1500  *  PCB Footprint: SW2_6R00X3R70X2R50  Option: Maskrom Key  [YC-6615B]
TP1500  *  [TEST]
TP1501  *  [TEST]
TP1502  *  [TEST]
TP1503  *  [TEST]
U1000  *  [BGA1088_23R00X23R00X2R00]  (parts G,H,U of 26)

### Nets
GND: C1500.2 C1501.2 C1502.2 C1503.2 C1504.2 C1505.2 C1506.2 D1500.2 R1510.2 SW1500.2 TP1501.1 TP1503.1
VCC_1V8: C1505.1 C1506.1 R1500.1 R1501.1 U1000.G20(VCCIO1_1V8) U1000.Y26(VCCIO3_1V8)
VCCA_1V8: C1503.1 R1502.1 R1503.1 U1000.AH18(SARADC_AVDD_1V8)
VDDA_0V75: C1504.1 U1000.AD3(OTP_VDDOTP_0V75)
BOOT_CONFIG: C1500.1 R1503.2 R1510.1 R1514.1 U1000.AM16(SARADC_IN0_BOOT)
ETH0_REFCLKO25M: R1511.1 U1000.AD30(GPIO2_C3_d)
ETH0_REFCLKO_25M: R1511.2 ; off-sheet ETH0_REFCLKO_25M
GMAC0_MCLKIN: R1512.1 U1000.AF34(GPIO4_C3_d)
GMAC0_MCLKINOUT: R1512.2 ; off-sheet GMAC0_MCLKINOUT
GMAC0_MDC: R1513.2 ; off-sheet GMAC0_MDC
GMAC0_MDC_SOC: R1513.1 U1000.AB34(GPIO4_C4_d)
GMAC0_MDIO: U1000.AB33(GPIO4_C5_d) ; off-sheet GMAC0_MDIO
GMAC0_RXCLK: U1000.AE32(GPIO2_B0_u) ; off-sheet GMAC0_RXCLK
GMAC0_RXD0: U1000.AD32(GPIO2_C1_d) ; off-sheet GMAC0_RXD0
GMAC0_RXD1: U1000.AD31(GPIO2_C2_d) ; off-sheet GMAC0_RXD1
GMAC0_RXD2: U1000.AC32(GPIO2_A6_u) ; off-sheet GMAC0_RXD2
GMAC0_RXD3: U1000.AC31(GPIO2_A7_u) ; off-sheet GMAC0_RXD3
GMAC0_RXDV_CRS: U1000.AE31(GPIO4_C2_d) ; off-sheet GMAC0_RXDV_CRS
GMAC0_TXCLK: R1506.2 ; off-sheet GMAC0_TXCLK
GMAC0_TXCLK_SOC: R1506.1 U1000.AE33(GPIO2_B3_d)
GMAC0_TXD0: R1507.2 ; off-sheet GMAC0_TXD0
GMAC0_TXD0_SOC: R1507.1 U1000.AD33(GPIO2_B6_d)
GMAC0_TXD1: R1508.2 ; off-sheet GMAC0_TXD1
GMAC0_TXD1_SOC: R1508.1 U1000.AD34(GPIO2_B7_d)
GMAC0_TXD2: R1504.2 ; off-sheet GMAC0_TXD2
GMAC0_TXD2_SOC: R1504.1 U1000.AC33(GPIO2_B1_u)
GMAC0_TXD3: R1505.2 ; off-sheet GMAC0_TXD3
GMAC0_TXD3_SOC: R1505.1 U1000.AC34(GPIO2_B2_u)
GMAC0_TXEN: R1509.2 ; off-sheet GMAC0_TXEN
GMAC0_TXEN_SOC: R1509.1 U1000.AE34(GPIO2_C0_d)
I2C3_SCL_M0: R1500.2 U1000.G27(GPIO1_C1_z) ; off-sheet I2C3_SCL_M0
I2C3_SDA_M0: R1501.2 U1000.G29(GPIO1_C0_z) ; off-sheet I2C3_SDA_M0
I2S0_LRCK_RX/PWM15_M2: U1000.D29(GPIO1_C6_d) ; off-sheet I2S0_LRCK_RX/PWM15_M2
I2S0_LRCK_TX: U1000.D30(GPIO1_C5_d) ; off-sheet I2S0_LRCK_TX
I2S0_MCLK: U1000.F30(GPIO1_C2_d) ; off-sheet I2S0_MCLK
I2S0_SCLK_RX/PWM11_M2: U1000.E30(GPIO1_C4_d) ; off-sheet I2S0_SCLK_RX/PWM11_M2
I2S0_SCLK_TX: U1000.E31(GPIO1_C3_d) ; off-sheet I2S0_SCLK_TX
I2S0_SDI0: U1000.D28(GPIO1_D4_d) ; off-sheet I2S0_SDI0
I2S0_SDI1/PWM1_M1: U1000.E28(GPIO1_D3_d) ; off-sheet I2S0_SDI1/PWM1_M1
I2S0_SDO0: U1000.E29(GPIO1_C7_d) ; off-sheet I2S0_SDO0
RECOVERY_KEY: C1501.1 R1502.2 TP1500.1 U1000.AL16(SARADC_IN1) ; off-sheet RECOVERY_KEY
SARADC_VIN5_HW_ID: C1502.1 U1000.AK15(SARADC_IN5) ; off-sheet SARADC_VIN5_HW_ID
NetD1500_1: D1500.1 R1514.2 SW1500.1 TP1502.1

Not connected (* = marked no-connect by the designer): U1000 AB30(GPIO2_B5_u)* AB31(GPIO2_B4_u)* AC30(GPIO2_C4_d)* AD4(NC)* AE30(GPIO2_C5_d)* AF18(TSADC_TEST_OUT_TS)* AF33(GPIO4_C6_d)* AK16(SARADC_IN2)* AK17(SARADC_IN7)* AL17(SARADC_IN6)* AM17(SARADC_IN4)* AN17(SARADC_IN3)* F26(GPIO1_D0_d)* F27(GPIO1_D1_d)* F28(GPIO1_D2_d)* G26(GPIO1_D5_d)*

### Notes on the sheet
- RK3588_G(VCCIO1 Domain)
- (near U1000) RK3588_U(SARADC/OTP)
- Note:
- Must be mounted
- RK3588_H(VCCIO3 Domain)
- BOOT MODE CONFIG
- Item
- Rup
- Rdown
- ADC
- VOL
- Boot sequence
- LEVEL1
- DNP
- 100K
- 0
- 0V
- USB
- LEVEL2
- LEVEL3
- 360K
- 20K
- 180K
- 682
- 1365
- 0.6V
- 0.3V
- EMMC-USB
- SD Card-USB
- LEVEL4
- LEVEL5
- 2047
- 2730
- 1.2V
- 0.9V
- FSPI M1-USB
- FSPI M0-USB
- LEVEL6
- 3412
- 1.5V
- FSPI M2-USB
- LEVEL7
- 4095
- 1.8V
- FSPI_M2-FSPI_M1-FSPI_M0
  -EMMC-SD Card-USB
- It is recommended to reserve
  this circuit to enter the
  MaskROM state
  for update firmware
- Caps of between dashed green lines and U1000
  should be placed under the U1000 package.
  Other caps should be placed close to the U1000 package
- Note:
  If BOOT_SARADC_IN0=0V after power-on reset,
  then system will enter into Maskrom mode.
- (in symbol SOC_RK3588, part G) VCCIO1 Domain; Operating Voltage=1.8V; SPI4_MISO_M0; /; UART3_RX_M0; I2C3_SDA_M0; SPI4_MOSI_M0; UART3_TX_M0; I2C3_SCL_M0; SPI4_CLK_M0; UART3_RTSN; PWM3_IR_M2; I2C6_SDA_M1; I2S0_MCLK; SPI4_CS0_M0; UART3_CTSN; PWM7_IR_M2; I2C6_SCL_M1; I2S0_SCLK; SPI4_CS1_M0; PWM11_IR_M2; I2C2_SDA_M3; PDM0_CLK1_M0; UART4_RTSN; I2C2_SCL_M3; I2S0_LRCK; PWM15_IR_M2; I2C4_SDA_M4; PDM0_CLK0_M0; UART4_CTSN; I2C4_SCL_M4; I2S0_SDO0; SPI1_MISO_M2; UART6_TX_M2; I2C7_SCL_M0; I2S0_SDO1; SPI1_MOSI_M2; UART6_RX_M2; I2C7_SDA_M0; PDM0_SDI1_M0; I2S0_SDO2/I2S0_SDI3; SPI1_CLK_M2; UART4_TX_M0; PWM0_M1; I2C1_SCL_M4; PDM0_SDI2_M0; I2S0_SDO3/I2S0_SDI2; SPI1_CS0_M2; UART4_RX_M0; PWM1_M1; I2C1_SDA_M4; PDM0_SDI3_M0; I2S0_SDI1; I2S0_SDI0; SPI1_CS1_M2; PDM0_SDI0_M0
- (in symbol SOC_RK3588, part H) VCCIO3 Domain; Operating Voltage=1.8V; /; UART6_RX_M0; FSPI_D0_M1; SDIO_D0_M0; GMAC0_RXD2; UART6_TX_M0; FSPI_D1_M1; SDIO_D1_M0; GMAC0_RXD3; I2C8_SCL_M1; UART6_RTSN_M0; FSPI_D2_M1; SDIO_D2_M0; GMAC0_RXCLK; I2C8_SDA_M1; UART6_CTSN_M0; FSPI_D3_M1; SDIO_D3_M0; GMAC0_TXD2; I2C3_SCL_M3; SDIO_CMD_M0; GMAC0_TXD3; I2C3_SDA_M3; FSPI_CLK_M1; SDIO_CLK_M0; GMAC0_TXCLK; I2C4_SDA_M1; UART7_RX_M0; FSPI_CS0N_M1; HDMI_TX1_SDA_M0; GMAC0_PTP_REFCLK; I2C4_SCL_M1; UART7_TX_M0; FSPI_CS1N_M1; HDMI_TX1_SCL_M0; GMAC0_PPSTRIG; I2C5_SCL_M4; UART1_RX_M0; I2S2_MCLK_M0; GMAC0_TXD0; I2C5_SDA_M4; UART1_TX_M0; I2S2_SCLK_M0; GMAC0_TXD1; I2C2_SDA_M1; UART1_RTSN_M0; SPI1_CLK_M0; I2S2_LRCK_M0; GMAC0_TXEN; I2C2_SCL_M1; UART1_CTSN_M0; SPI1_MISO_M0; GMAC0_RXD0; I2C6_SDA_M2; UART9_TX_M0; SPI1_MOSI_M0; GMAC0_RXD1; I2C6_SCL_M2; SPI1_CS0_M0; I2S2_SDI_M0; ETH0_REFCLKO_25M; TEST_CLKOUT_M1; UART9_RX_M0; SPI1_CS1_M0; HDMI_TX1_CEC_M0; GMAC0_PPSCLK; CLK32K_OUT1; UART7_RTSN_M0; SPI3_CS0_M0; PWM2_M2; GMAC0_RXDV_CRS; I2C7_SCL_M1; PWM4_M1; SPI3_CS1_M0; I2S2_SDO_M0; GMAC0_MCLKINOUT; I2C7_SDA_M1; UART9_RTSN_M0; SPI3_MISO_M0; PWM5_M2; GMAC0_MDC; I2C0_SCL_M1; UART9_CTSN_M0; SPI3_MOSI_M0; PWM6_M2; GMAC0_MDIO; I2C0_SDA_M1; UART7_CTSN_M0; SPI3_CLK_M0; PWM7_IR_M3; GMAC0_TXER
- (in symbol SOC_RK3588, part U) SARADC; Recovery/; 12-bit 1MS/s; OTP; TSADC

### Library data of the parts
C1500 = CAP NP: cap,1.00nF,+/-10%,25V,X5R,C0201; Part Reference: C1500; Manufacturer: TDK; Value: 1nF; RK PN: C0603X5R1E102K030BA; Priority: A; Tolerance: 10%; PCB Footprint: C0201; Part Type: C0201; Manufacturer PN: C0603X5R1E102K030BA; Created by: JJJ
C1501 = CAP NP: cap,1.00nF,+/-10%,25V,X5R,C0201; Part Reference: C1501; Manufacturer: TDK; Value: 1nF; RK PN: C0603X5R1E102K030BA; Priority: A; Tolerance: 10%; PCB Footprint: C0201; Part Type: C0201; Manufacturer PN: C0603X5R1E102K030BA; Created by: JJJ
C1502 = CAP NP: cap,1.00nF,+/-10%,25V,X5R,C0201; Part Reference: C1502; Manufacturer: TDK; Value: 1nF; RK PN: C0603X5R1E102K030BA; Priority: A; Tolerance: 10%; PCB Footprint: C0201; Part Type: C0201; Manufacturer PN: C0603X5R1E102K030BA; Created by: JJJ
C1503 = CAP NP: cap,100.00nF,+/-10%,10V,X5R,C0201; Part Reference: C1503; Manufacturer: TDK; Value: 100nF; RK PN: C0603X5R1A104K030BC; Priority: A; Tolerance: 10%; PCB Footprint: C0201; Part Type: C0201; Manufacturer PN: C0603X5R1A104K030BC; Created by: JJJ
C1504 = CAP NP: cap,100.00nF,+/-10%,10V,X5R,C0201; Part Reference: C1504; Manufacturer PN: C0603X5R1A104K030BC; Manufacturer: TDK; Value: 100nF; Tolerance: 10%; Priority: A; PCB Footprint: C0201; Created by: JJJ; Part Type: C0201; RK PN: C0603X5R1A104K030BC
C1505 = CAP NP: cap,100.00nF,+/-10%,10V,X5R,C0201; Part Reference: C1505; Manufacturer PN: C0603X5R1A104K030BC; Manufacturer: TDK; Value: 100nF; Tolerance: 10%; Priority: A; PCB Footprint: C0201; Created by: JJJ; Part Type: C0201; RK PN: C0603X5R1A104K030BC
C1506 = CAP NP: cap,100.00nF,+/-10%,10V,X5R,C0201; Part Reference: C1506; Manufacturer: TDK; Value: 100nF; RK PN: C0603X5R1A104K030BC; Priority: A; Tolerance: 10%; PCB Footprint: C0201; Part Type: C0201; Manufacturer PN: C0603X5R1A104K030BC; Created by: JJJ
D1500 = DIODE BI_DIR TRIG: 1-Line, Bi-directional, Transient Voltage Suppressors.17.5pF.; Part Reference: D1500; Manufacturer: WillSemi(О¤¶ы°лµјМе); Value: ESD5451N; Priority: A; PCB Footprint: ESD0402; Created by: JJJ; Manufacturer PN: ESD5451N; Part Type: ESD_TVS; RK PN: ESD5451N
R1500 = RESISTOR_Dup1: НЁУГєсД¤µзЧи,2K2,+/-5%,R0201,1/20W.; Part Reference: R1500; Manufacturer: YAGEO; Value: 2.2K; RK PN: RC0201JR-072K2L; Priority: A; Wattage: 1/20W; Part Type: НЁУГєсД¤µзЧи; Manufacturer PN: RC0201JR-072K2L; Created by: YTL
R1501 = RESISTOR_Dup1: НЁУГєсД¤µзЧи,2K2,+/-5%,R0201,1/20W.; Part Reference: R1501; Manufacturer PN: RC0201JR-072K2L; Manufacturer: YAGEO; Value: 2.2K; Wattage: 1/20W; Priority: A; Created by: YTL; Part Type: НЁУГєсД¤µзЧи; RK PN: RC0201JR-072K2L
R1502 = RESISTOR_Dup1: НЁУГєсД¤µзЧи,10K,+/-1%,R0402,1/16W.; Part Reference: R1502; Manufacturer PN: RC0402FR-0710KL; Manufacturer: YAGEO; Wattage: 1/16W; Priority: A; PCB Footprint: R0402; Value: 10K; Created by: YTL; Part Type: НЁУГєсД¤µзЧи; RK PN: RC0402FR-0710KL
R1503 = RESISTOR_Dup1: НЁУГєсД¤µзЧи,100K,+/-1%,R0402,1/16W.; Part Reference: R1503; Manufacturer: YAGEO; RK PN: RC0402FR-07100KL; Priority: A; Wattage: 1/16W; PCB Footprint: R0402; Value: 100K; Part Type: НЁУГєсД¤µзЧи; Manufacturer PN: RC0402FR-07100KL; Created by: YTL
R1504 = RESISTOR_Dup1: НЁУГєсД¤µзЧи,0R,+/-5%,R0201,1/20W.; Part Reference: R1504; Manufacturer: YAGEO; RK PN: RC0201JR-070RL; Priority: A; Wattage: 1/20W; Value: 0R; Part Type: НЁУГєсД¤µзЧи; Manufacturer PN: RC0201JR-070RL; Created by: YTL
R1505 = RESISTOR_Dup1: НЁУГєсД¤µзЧи,0R,+/-5%,R0201,1/20W.; Part Reference: R1505; Manufacturer PN: RC0201JR-070RL; Manufacturer: YAGEO; Wattage: 1/20W; Priority: A; Value: 0R; Created by: YTL; Part Type: НЁУГєсД¤µзЧи; RK PN: RC0201JR-070RL
R1506 = RESISTOR_Dup1: НЁУГєсД¤µзЧи,0R,+/-5%,R0201,1/20W.; Part Reference: R1506; Manufacturer: YAGEO; RK PN: RC0201JR-070RL; Priority: A; Wattage: 1/20W; Value: 0R; Part Type: НЁУГєсД¤µзЧи; Manufacturer PN: RC0201JR-070RL; Created by: YTL
R1507 = RESISTOR_Dup1: НЁУГєсД¤µзЧи,0R,+/-5%,R0201,1/20W.; Part Reference: R1507; Manufacturer: YAGEO; RK PN: RC0201JR-070RL; Priority: A; Wattage: 1/20W; Value: 0R; Part Type: НЁУГєсД¤µзЧи; Manufacturer PN: RC0201JR-070RL; Created by: YTL
R1508 = RESISTOR_Dup1: НЁУГєсД¤µзЧи,0R,+/-5%,R0201,1/20W.; Part Reference: R1508; Manufacturer: YAGEO; RK PN: RC0201JR-070RL; Priority: A; Wattage: 1/20W; Value: 0R; Part Type: НЁУГєсД¤µзЧи; Manufacturer PN: RC0201JR-070RL; Created by: YTL
R1509 = RESISTOR_Dup1: НЁУГєсД¤µзЧи,0R,+/-5%,R0201,1/20W.; Part Reference: R1509; Manufacturer: YAGEO; RK PN: RC0201JR-070RL; Priority: A; Wattage: 1/20W; Value: 0R; Part Type: НЁУГєсД¤µзЧи; Manufacturer PN: RC0201JR-070RL; Created by: YTL
R1510 = RESISTOR_Dup1: Did Not Place.; Part Reference: R1510; Manufacturer PN: DNPR0402; Value: DNP; Priority: A; PCB Footprint: R0402; Created by: JJJ; Part Type: DNP; RK PN: DNPR0402
R1511 = RESISTOR_Dup1: НЁУГєсД¤µзЧи,0R,+/-5%,R0201,1/20W.; Part Reference: R1511; Manufacturer PN: RC0201JR-070RL; Manufacturer: YAGEO; Wattage: 1/20W; Priority: A; Value: 0R; Created by: YTL; Part Type: НЁУГєсД¤µзЧи; RK PN: RC0201JR-070RL
R1512 = RESISTOR_Dup1: НЁУГєсД¤µзЧи,0R,+/-5%,R0201,1/20W.; Part Reference: R1512; Manufacturer PN: RC0201JR-070RL; Manufacturer: YAGEO; Wattage: 1/20W; Priority: A; Value: 0R; Created by: YTL; Part Type: НЁУГєсД¤µзЧи; RK PN: RC0201JR-070RL
R1513 = RESISTOR_Dup1: НЁУГєсД¤µзЧи,0R,+/-5%,R0201,1/20W.; Part Reference: R1513; Manufacturer PN: RC0201JR-070RL; Manufacturer: YAGEO; Wattage: 1/20W; Priority: A; Value: 0R; Created by: YTL; Part Type: НЁУГєсД¤µзЧи; RK PN: RC0201JR-070RL
R1514 = RESISTOR_Dup1: НЁУГєсД¤µзЧи,100R,+/-5%,R0402,1/16W.; Part Reference: R1514; Manufacturer: YAGEO; RK PN: RC0402JR-07100RL; Priority: A; Wattage: 1/16W; PCB Footprint: R0402; Value: 100R; Part Type: НЁУГєсД¤µзЧи; Manufacturer PN: RC0402JR-07100RL; Created by: YTL
SW1500 = KEY_2PIN: 2ЅЕМщЖ¬Ј¬6MMx3.7MM°ґјь; Part Reference: SW1500; Manufacturer: Сw»ЄµзЧУ; Value: TS-1125HS; Priority: A; Created by: YWQ; Manufacturer Part Number: TS-1125HS; Part Type: KEY; RK PN: TS-1125HS
TP1500 = TP: Test Point 0.7mm; Part Reference: TP1500; PCB Footprint: TP_0R70; Value: TP_0.7; Priority: A; RK PN: TESTPOINT_0R7; Created by: JJJ; Part Type: TP
TP1501 = TP: Test Point 0.7mm; Part Reference: TP1501; PCB Footprint: TP_0R70; Value: TP_0.7; Priority: A; RK PN: TESTPOINT_0R7; Created by: JJJ; Part Type: TP
TP1502 = TP: Test Point 0.7mm; Part Reference: TP1502; PCB Footprint: TP_0R70; Value: TP_0.7; RK PN: TESTPOINT_0R7; Priority: A; Part Type: TP; Created by: JJJ
TP1503 = TP: Test Point 0.7mm; Part Reference: TP1503; PCB Footprint: TP_0R70; Value: TP_0.7; Priority: A; RK PN: TESTPOINT_0R7; Created by: JJJ; Part Type: TP
U1000 = SOC_RK3588: as U1000 on sheet 14.RK3588_USB30_USB20_Ctrl; Created by: YWQ; Manufacturer PN: RK3588; Part Type: SOC; RK PN: RK3588; PCB Footprint: BGA1088_23R00X23R00X2R00

## Sheet 16.RK3588_MIPI  Interface.SchDoc
size 430 x 350 mm; Revision: V2.1; Schematic Page Number: 11; Page Number: 16; Check: <Checker>; Schematic Name: RK_NVR_DEMO1_RK3588_LP4/4x_V21; Page Count: 43; Page name: 16.RK3588_MIPI  Interface; Designer: Zhangdz; Schematic Page Count: 99; Revcode: V2.1; DsnPath: E:\Work\SBER\RK3588_SOM\temp\RK_NVR_DEMO1_RK3588_LP4XD200P232SD8_V21_20211228.DSN; SchematicName: RK_NVR_DEMO1_RK3588_LP4/4x_V21; PageName: 16.RK3588_MIPI  Interface; PageSize: Custom; TopSchematic: True
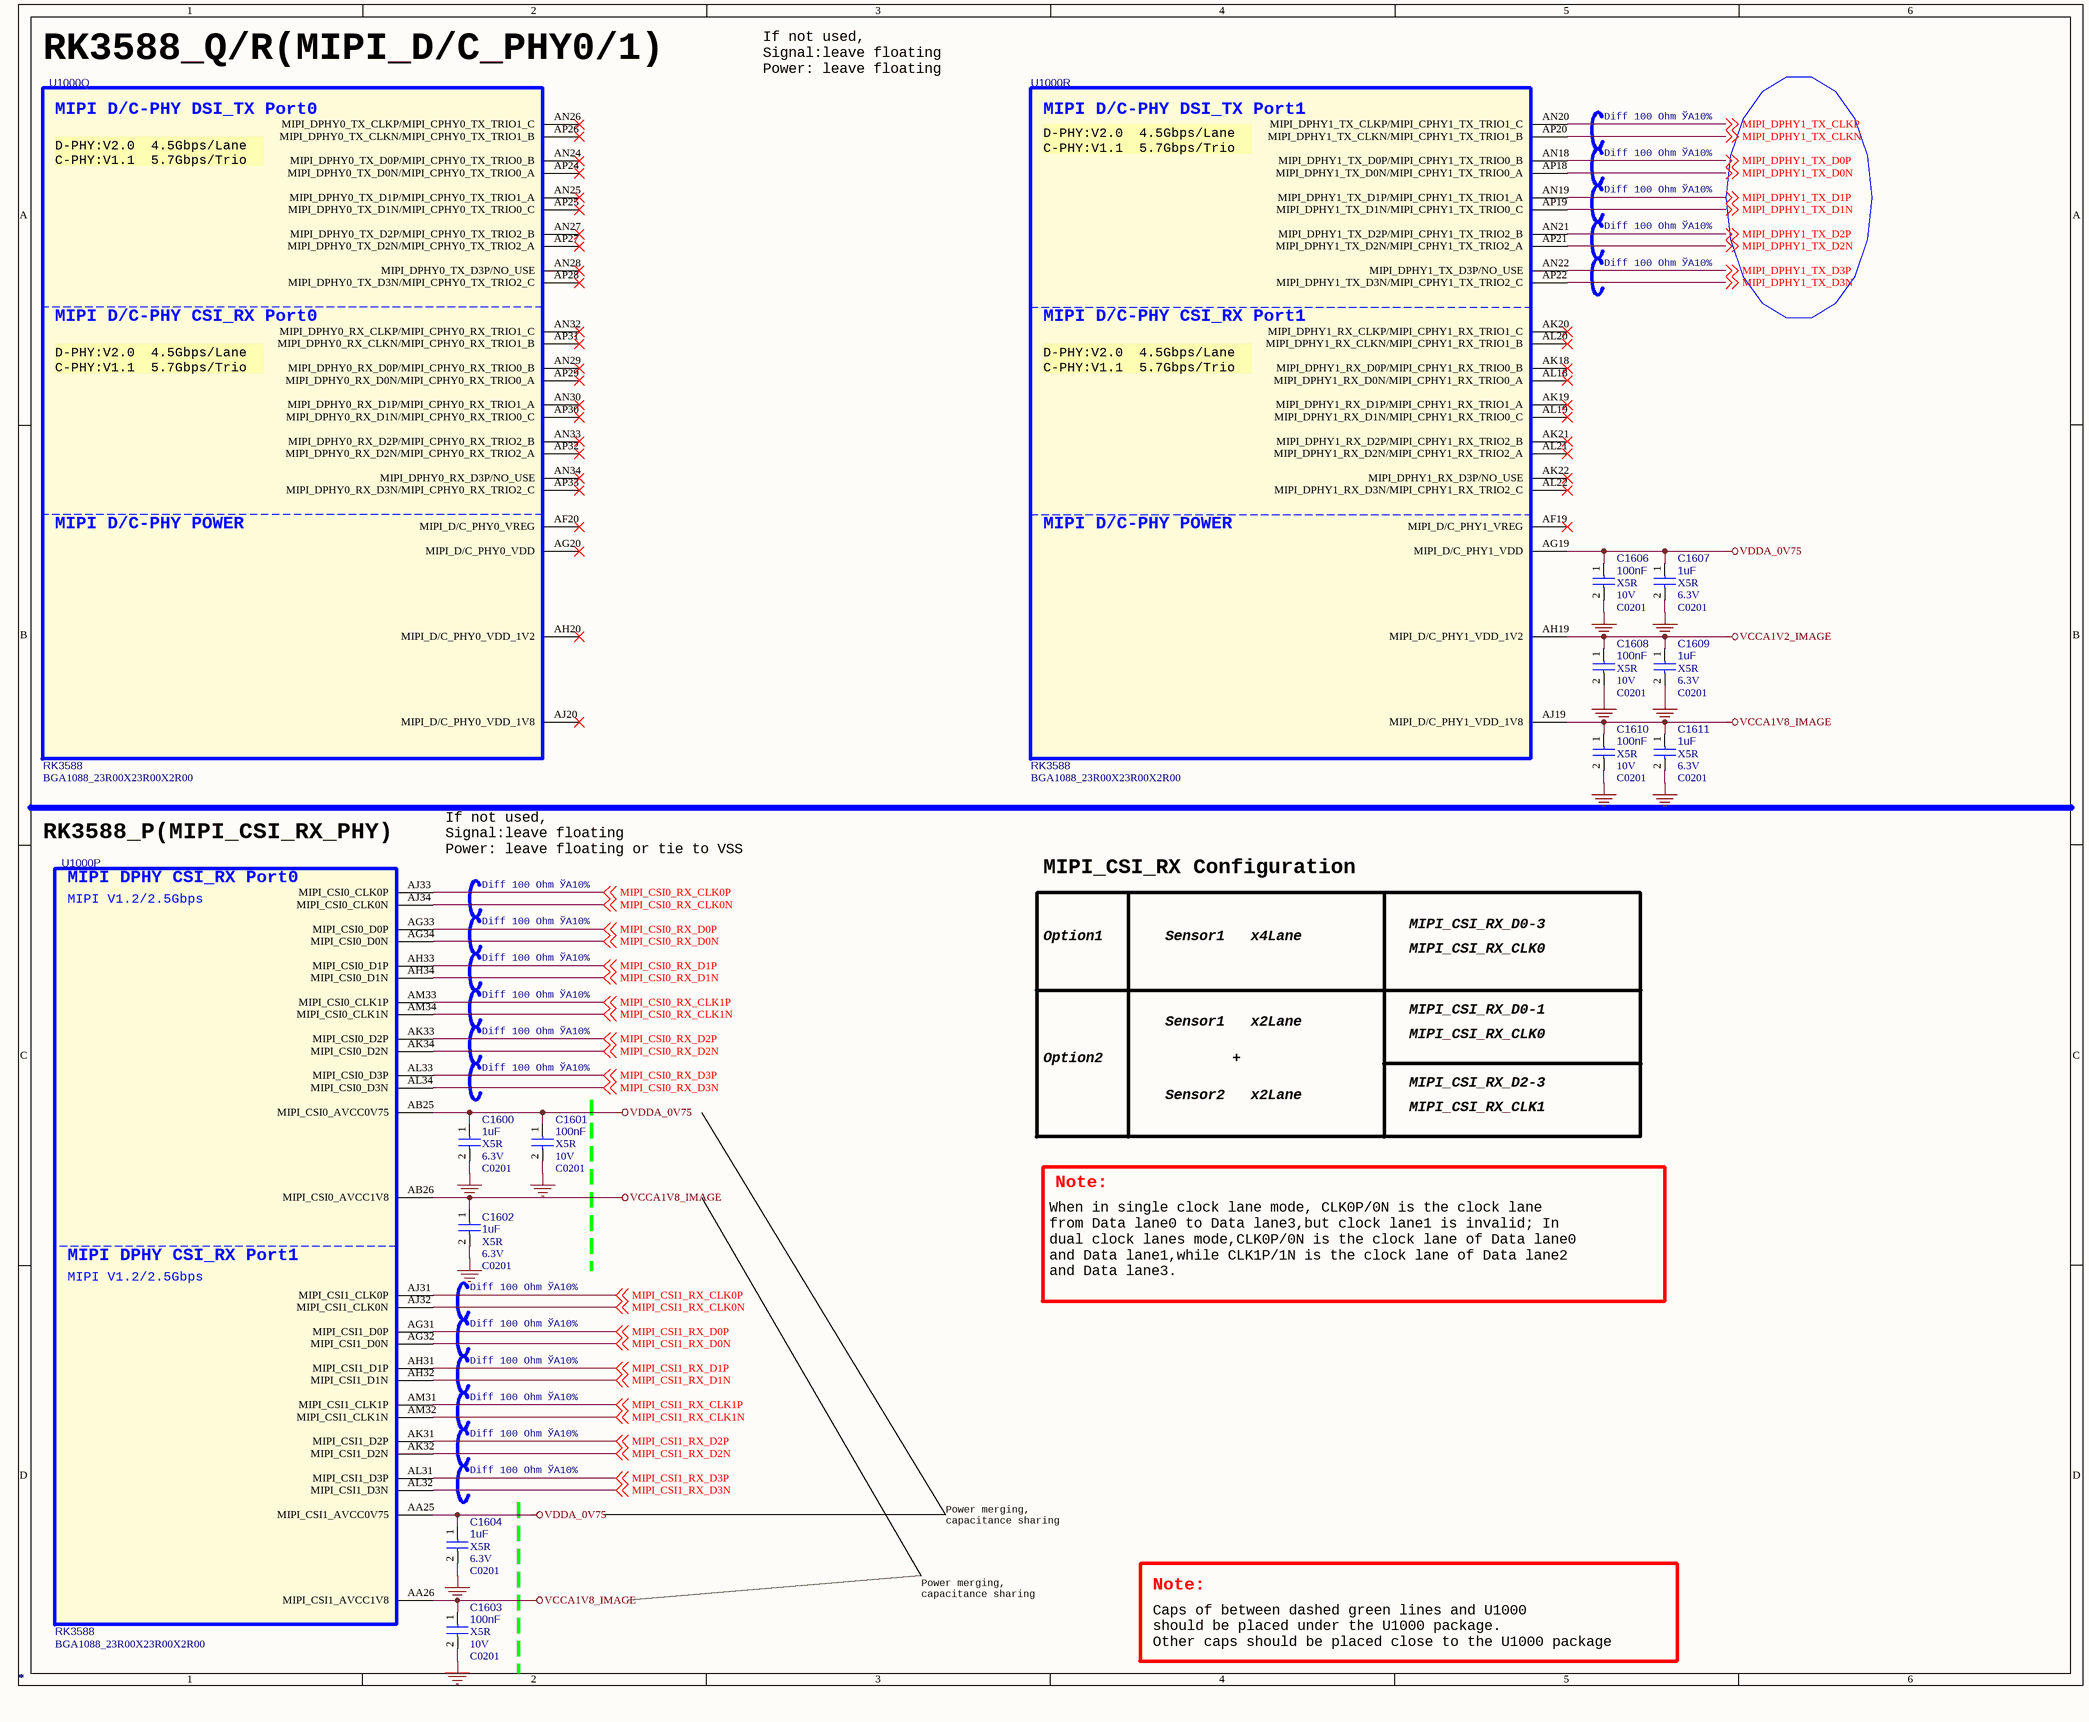
[diagram p31: 16.RK3588_MIPI  Interface.SchDoc]

### Parts
C1600  *  Voltage: 6.3V  Dielectric: X5R  [C0201]
C1601  *  Voltage: 10V  Dielectric: X5R  [C0201]
C1602  *  Voltage: 6.3V  Dielectric: X5R  [C0201]
C1603  *  Voltage: 10V  Dielectric: X5R  [C0201]
C1604  *  Voltage: 6.3V  Dielectric: X5R  [C0201]
C1606  *  Voltage: 10V  Dielectric: X5R  [C0201]
C1607  *  Voltage: 6.3V  Dielectric: X5R  [C0201]
C1608  *  Voltage: 10V  Dielectric: X5R  [C0201]
C1609  *  Voltage: 6.3V  Dielectric: X5R  [C0201]
C1610  *  Voltage: 10V  Dielectric: X5R  [C0201]
C1611  *  Voltage: 6.3V  Dielectric: X5R  [C0201]
U1000  *  [BGA1088_23R00X23R00X2R00]  (parts P,Q,R of 26)

### Nets
GND: C1600.2 C1601.2 C1602.2 C1603.2 C1604.2 C1606.2 C1607.2 C1608.2 C1609.2 C1610.2 C1611.2
VCCA1V2_IMAGE: C1608.1 C1609.1 U1000.AH19(MIPI_D/C_PHY1_VDD_1V2)
VCCA1V8_IMAGE: C1602.1 C1603.1 C1610.1 C1611.1 U1000.AA26(MIPI_CSI1_AVCC1V8) U1000.AB26(MIPI_CSI0_AVCC1V8) U1000.AJ19(MIPI_D/C_PHY1_VDD_1V8)
VDDA_0V75: C1600.1 C1601.1 C1604.1 C1606.1 C1607.1 U1000.AA25(MIPI_CSI1_AVCC0V75) U1000.AB25(MIPI_CSI0_AVCC0V75) U1000.AG19(MIPI_D/C_PHY1_VDD)
MIPI_CSI0_RX_CLK0N: U1000.AJ34(MIPI_CSI0_CLK0N) ; off-sheet MIPI_CSI0_RX_CLK0N
MIPI_CSI0_RX_CLK0P: U1000.AJ33(MIPI_CSI0_CLK0P) ; off-sheet MIPI_CSI0_RX_CLK0P
MIPI_CSI0_RX_CLK1N: U1000.AM34(MIPI_CSI0_CLK1N) ; off-sheet MIPI_CSI0_RX_CLK1N
MIPI_CSI0_RX_CLK1P: U1000.AM33(MIPI_CSI0_CLK1P) ; off-sheet MIPI_CSI0_RX_CLK1P
MIPI_CSI0_RX_D0N: U1000.AG34(MIPI_CSI0_D0N) ; off-sheet MIPI_CSI0_RX_D0N
MIPI_CSI0_RX_D0P: U1000.AG33(MIPI_CSI0_D0P) ; off-sheet MIPI_CSI0_RX_D0P
MIPI_CSI0_RX_D1N: U1000.AH34(MIPI_CSI0_D1N) ; off-sheet MIPI_CSI0_RX_D1N
MIPI_CSI0_RX_D1P: U1000.AH33(MIPI_CSI0_D1P) ; off-sheet MIPI_CSI0_RX_D1P
MIPI_CSI0_RX_D2N: U1000.AK34(MIPI_CSI0_D2N) ; off-sheet MIPI_CSI0_RX_D2N
MIPI_CSI0_RX_D2P: U1000.AK33(MIPI_CSI0_D2P) ; off-sheet MIPI_CSI0_RX_D2P
MIPI_CSI0_RX_D3N: U1000.AL34(MIPI_CSI0_D3N) ; off-sheet MIPI_CSI0_RX_D3N
MIPI_CSI0_RX_D3P: U1000.AL33(MIPI_CSI0_D3P) ; off-sheet MIPI_CSI0_RX_D3P
MIPI_CSI1_RX_CLK0N: U1000.AJ32(MIPI_CSI1_CLK0N) ; off-sheet MIPI_CSI1_RX_CLK0N
MIPI_CSI1_RX_CLK0P: U1000.AJ31(MIPI_CSI1_CLK0P) ; off-sheet MIPI_CSI1_RX_CLK0P
MIPI_CSI1_RX_CLK1N: U1000.AM32(MIPI_CSI1_CLK1N) ; off-sheet MIPI_CSI1_RX_CLK1N
MIPI_CSI1_RX_CLK1P: U1000.AM31(MIPI_CSI1_CLK1P) ; off-sheet MIPI_CSI1_RX_CLK1P
MIPI_CSI1_RX_D0N: U1000.AG32(MIPI_CSI1_D0N) ; off-sheet MIPI_CSI1_RX_D0N
MIPI_CSI1_RX_D0P: U1000.AG31(MIPI_CSI1_D0P) ; off-sheet MIPI_CSI1_RX_D0P
MIPI_CSI1_RX_D1N: U1000.AH32(MIPI_CSI1_D1N) ; off-sheet MIPI_CSI1_RX_D1N
MIPI_CSI1_RX_D1P: U1000.AH31(MIPI_CSI1_D1P) ; off-sheet MIPI_CSI1_RX_D1P
MIPI_CSI1_RX_D2N: U1000.AK32(MIPI_CSI1_D2N) ; off-sheet MIPI_CSI1_RX_D2N
MIPI_CSI1_RX_D2P: U1000.AK31(MIPI_CSI1_D2P) ; off-sheet MIPI_CSI1_RX_D2P
MIPI_CSI1_RX_D3N: U1000.AL32(MIPI_CSI1_D3N) ; off-sheet MIPI_CSI1_RX_D3N
MIPI_CSI1_RX_D3P: U1000.AL31(MIPI_CSI1_D3P) ; off-sheet MIPI_CSI1_RX_D3P
MIPI_DPHY1_TX_CLKN: U1000.AP20(MIPI_DPHY1_TX_CLKN/MIPI_CPHY1_TX_TRIO1_B) ; off-sheet MIPI_DPHY1_TX_CLKN
MIPI_DPHY1_TX_CLKP: U1000.AN20(MIPI_DPHY1_TX_CLKP/MIPI_CPHY1_TX_TRIO1_C) ; off-sheet MIPI_DPHY1_TX_CLKP
MIPI_DPHY1_TX_D0N: U1000.AP18(MIPI_DPHY1_TX_D0N/MIPI_CPHY1_TX_TRIO0_A) ; off-sheet MIPI_DPHY1_TX_D0N
MIPI_DPHY1_TX_D0P: U1000.AN18(MIPI_DPHY1_TX_D0P/MIPI_CPHY1_TX_TRIO0_B) ; off-sheet MIPI_DPHY1_TX_D0P
MIPI_DPHY1_TX_D1N: U1000.AP19(MIPI_DPHY1_TX_D1N/MIPI_CPHY1_TX_TRIO0_C) ; off-sheet MIPI_DPHY1_TX_D1N
MIPI_DPHY1_TX_D1P: U1000.AN19(MIPI_DPHY1_TX_D1P/MIPI_CPHY1_TX_TRIO1_A) ; off-sheet MIPI_DPHY1_TX_D1P
MIPI_DPHY1_TX_D2N: U1000.AP21(MIPI_DPHY1_TX_D2N/MIPI_CPHY1_TX_TRIO2_A) ; off-sheet MIPI_DPHY1_TX_D2N
MIPI_DPHY1_TX_D2P: U1000.AN21(MIPI_DPHY1_TX_D2P/MIPI_CPHY1_TX_TRIO2_B) ; off-sheet MIPI_DPHY1_TX_D2P
MIPI_DPHY1_TX_D3N: U1000.AP22(MIPI_DPHY1_TX_D3N/MIPI_CPHY1_TX_TRIO2_C) ; off-sheet MIPI_DPHY1_TX_D3N
MIPI_DPHY1_TX_D3P: U1000.AN22(MIPI_DPHY1_TX_D3P/NO_USE) ; off-sheet MIPI_DPHY1_TX_D3P

Not connected (* = marked no-connect by the designer): U1000 AF19(MIPI_D/C_PHY1_VREG)* AF20(MIPI_D/C_PHY0_VREG)* AG20(MIPI_D/C_PHY0_VDD)* AH20(MIPI_D/C_PHY0_VDD_1V2)* AJ20(MIPI_D/C_PHY0_VDD_1V8)* AK18(MIPI_DPHY1_RX_D0P/MIPI_CPHY1_RX_TRIO0_B)* AK19(MIPI_DPHY1_RX_D1P/MIPI_CPHY1_RX_TRIO1_A)* AK20(MIPI_DPHY1_RX_CLKP/MIPI_CPHY1_RX_TRIO1_C)* AK21(MIPI_DPHY1_RX_D2P/MIPI_CPHY1_RX_TRIO2_B)* AK22(MIPI_DPHY1_RX_D3P/NO_USE)* AL18(MIPI_DPHY1_RX_D0N/MIPI_CPHY1_RX_TRIO0_A)* AL19(MIPI_DPHY1_RX_D1N/MIPI_CPHY1_RX_TRIO0_C)* AL20(MIPI_DPHY1_RX_CLKN/MIPI_CPHY1_RX_TRIO1_B)* AL21(MIPI_DPHY1_RX_D2N/MIPI_CPHY1_RX_TRIO2_A)* AL22(MIPI_DPHY1_RX_D3N/MIPI_CPHY1_RX_TRIO2_C)* AN24(MIPI_DPHY0_TX_D0P/MIPI_CPHY0_TX_TRIO0_B)* AN25(MIPI_DPHY0_TX_D1P/MIPI_CPHY0_TX_TRIO1_A)* AN26(MIPI_DPHY0_TX_CLKP/MIPI_CPHY0_TX_TRIO1_C)* AN27(MIPI_DPHY0_TX_D2P/MIPI_CPHY0_TX_TRIO2_B)* AN28(MIPI_DPHY0_TX_D3P/NO_USE)* AN29(MIPI_DPHY0_RX_D0P/MIPI_CPHY0_RX_TRIO0_B)* AN30(MIPI_DPHY0_RX_D1P/MIPI_CPHY0_RX_TRIO1_A)* AN32(MIPI_DPHY0_RX_CLKP/MIPI_CPHY0_RX_TRIO1_C)* AN33(MIPI_DPHY0_RX_D2P/MIPI_CPHY0_RX_TRIO2_B)* AN34(MIPI_DPHY0_RX_D3P/NO_USE)* AP24(MIPI_DPHY0_TX_D0N/MIPI_CPHY0_TX_TRIO0_A)* AP25(MIPI_DPHY0_TX_D1N/MIPI_CPHY0_TX_TRIO0_C)* AP26(MIPI_DPHY0_TX_CLKN/MIPI_CPHY0_TX_TRIO1_B)* AP27(MIPI_DPHY0_TX_D2N/MIPI_CPHY0_TX_TRIO2_A)* AP28(MIPI_DPHY0_TX_D3N/MIPI_CPHY0_TX_TRIO2_C)* AP29(MIPI_DPHY0_RX_D0N/MIPI_CPHY0_RX_TRIO0_A)* AP30(MIPI_DPHY0_RX_D1N/MIPI_CPHY0_RX_TRIO0_C)* AP31(MIPI_DPHY0_RX_CLKN/MIPI_CPHY0_RX_TRIO1_B)* AP32(MIPI_DPHY0_RX_D2N/MIPI_CPHY0_RX_TRIO2_A)* AP33(MIPI_DPHY0_RX_D3N/MIPI_CPHY0_RX_TRIO2_C)*

### Notes on the sheet
- RK3588_Q/R(MIPI_D/C_PHY0/1)
- If not used,
  Signal:leave floating
  Power: leave floating
- Diff 100 Ohm ЎА10%
- RK3588_P(MIPI_CSI_RX_PHY)
- If not used,
  Signal:leave floating
  Power: leave floating or tie to VSS
- MIPI_CSI_RX Configuration
- Option1
- Sensor1
- x4Lane
- MIPI_CSI_RX_D0-3
- MIPI_CSI_RX_CLK0
- x2Lane
- MIPI_CSI_RX_D0-1
- Option2
- Sensor2
- +
- MIPI_CSI_RX_D2-3
- MIPI_CSI_RX_CLK1
- Note:
- When in single clock lane mode, CLK0P/0N is the clock lane
  from Data lane0 to Data lane3,but clock lane1 is invalid; In
  dual clock lanes mode,CLK0P/0N is the clock lane of Data lane0
  and Data lane1,while CLK1P/1N is the clock lane of Data lane2
  and Data lane3.
- Power merging,
  capacitance sharing
- Caps of between dashed green lines and U1000
  should be placed under the U1000 package.
  Other caps should be placed close to the U1000 package
- (in symbol SOC_RK3588, part P) MIPI DPHY CSI_RX Port0; MIPI V1.2/2.5Gbps; MIPI DPHY CSI_RX Port1
- (in symbol SOC_RK3588, part Q) MIPI D/C-PHY DSI_TX Port0; D-PHY:V2.0  4.5Gbps/Lane / C-PHY:V1.1  5.7Gbps/Trio; MIPI D/C-PHY CSI_RX Port0; MIPI D/C-PHY POWER
- (in symbol SOC_RK3588, part R) MIPI D/C-PHY DSI_TX Port1; D-PHY:V2.0  4.5Gbps/Lane / C-PHY:V1.1  5.7Gbps/Trio; MIPI D/C-PHY CSI_RX Port1; MIPI D/C-PHY POWER

### Library data of the parts
C1600 = CAP NP: cap,1.00uF,+/-20%,6.3V,X5R,C0201; Part Reference: C1600; Manufacturer: TDK; Value: 1uF; RK PN: C0603X5R0J105M030BC; Priority: A; Tolerance: 20%; PCB Footprint: C0201; Part Type: C0201; Manufacturer PN: C0603X5R0J105M030BC; Created by: JJJ
C1601 = CAP NP: cap,100.00nF,+/-10%,10V,X5R,C0201; Part Reference: C1601; Manufacturer: TDK; Value: 100nF; RK PN: C0603X5R1A104K030BC; Priority: A; Tolerance: 10%; PCB Footprint: C0201; Part Type: C0201; Manufacturer PN: C0603X5R1A104K030BC; Created by: JJJ
C1602 = CAP NP: cap,1.00uF,+/-20%,6.3V,X5R,C0201; Part Reference: C1602; Manufacturer: TDK; Value: 1uF; RK PN: C0603X5R0J105M030BC; Priority: A; Tolerance: 20%; PCB Footprint: C0201; Part Type: C0201; Manufacturer PN: C0603X5R0J105M030BC; Created by: JJJ
C1603 = CAP NP: cap,100.00nF,+/-10%,10V,X5R,C0201; Part Reference: C1603; Manufacturer: TDK; Value: 100nF; RK PN: C0603X5R1A104K030BC; Priority: A; Tolerance: 10%; PCB Footprint: C0201; Part Type: C0201; Manufacturer PN: C0603X5R1A104K030BC; Created by: JJJ
C1604 = CAP NP: cap,1.00uF,+/-20%,6.3V,X5R,C0201; Part Reference: C1604; Manufacturer PN: C0603X5R0J105M030BC; Manufacturer: TDK; Value: 1uF; Tolerance: 20%; Priority: A; PCB Footprint: C0201; Created by: JJJ; Part Type: C0201; RK PN: C0603X5R0J105M030BC
C1606 = CAP NP: cap,100.00nF,+/-10%,10V,X5R,C0201; Part Reference: C1606; Manufacturer PN: C0603X5R1A104K030BC; Manufacturer: TDK; Value: 100nF; Tolerance: 10%; Priority: A; PCB Footprint: C0201; Created by: JJJ; Part Type: C0201; RK PN: C0603X5R1A104K030BC
C1607 = CAP NP: cap,1.00uF,+/-20%,6.3V,X5R,C0201; Part Reference: C1607; Manufacturer: TDK; Value: 1uF; RK PN: C0603X5R0J105M030BC; Priority: A; Tolerance: 20%; PCB Footprint: C0201; Part Type: C0201; Manufacturer PN: C0603X5R0J105M030BC; Created by: JJJ
C1608 = CAP NP: cap,100.00nF,+/-10%,10V,X5R,C0201; Part Reference: C1608; Manufacturer PN: C0603X5R1A104K030BC; Manufacturer: TDK; Value: 100nF; Tolerance: 10%; Priority: A; PCB Footprint: C0201; Created by: JJJ; Part Type: C0201; RK PN: C0603X5R1A104K030BC
C1609 = CAP NP: cap,1.00uF,+/-20%,6.3V,X5R,C0201; Part Reference: C1609; Manufacturer: TDK; Value: 1uF; RK PN: C0603X5R0J105M030BC; Priority: A; Tolerance: 20%; PCB Footprint: C0201; Part Type: C0201; Manufacturer PN: C0603X5R0J105M030BC; Created by: JJJ
C1610 = CAP NP: cap,100.00nF,+/-10%,10V,X5R,C0201; Part Reference: C1610; Manufacturer PN: C0603X5R1A104K030BC; Manufacturer: TDK; Value: 100nF; Tolerance: 10%; Priority: A; PCB Footprint: C0201; Created by: JJJ; Part Type: C0201; RK PN: C0603X5R1A104K030BC
C1611 = CAP NP: cap,1.00uF,+/-20%,6.3V,X5R,C0201; Part Reference: C1611; Manufacturer: TDK; Value: 1uF; RK PN: C0603X5R0J105M030BC; Priority: A; Tolerance: 20%; PCB Footprint: C0201; Part Type: C0201; Manufacturer PN: C0603X5R0J105M030BC; Created by: JJJ
U1000 = SOC_RK3588: as U1000 on sheet 14.RK3588_USB30_USB20_Ctrl; RK PN: RK3588; Part Type: SOC; Manufacturer PN: RK3588; Created by: YWQ; PCB Footprint: BGA1088_23R00X23R00X2R00